# Altium project Electronic Load.PrjPcb (part 1 of 3)
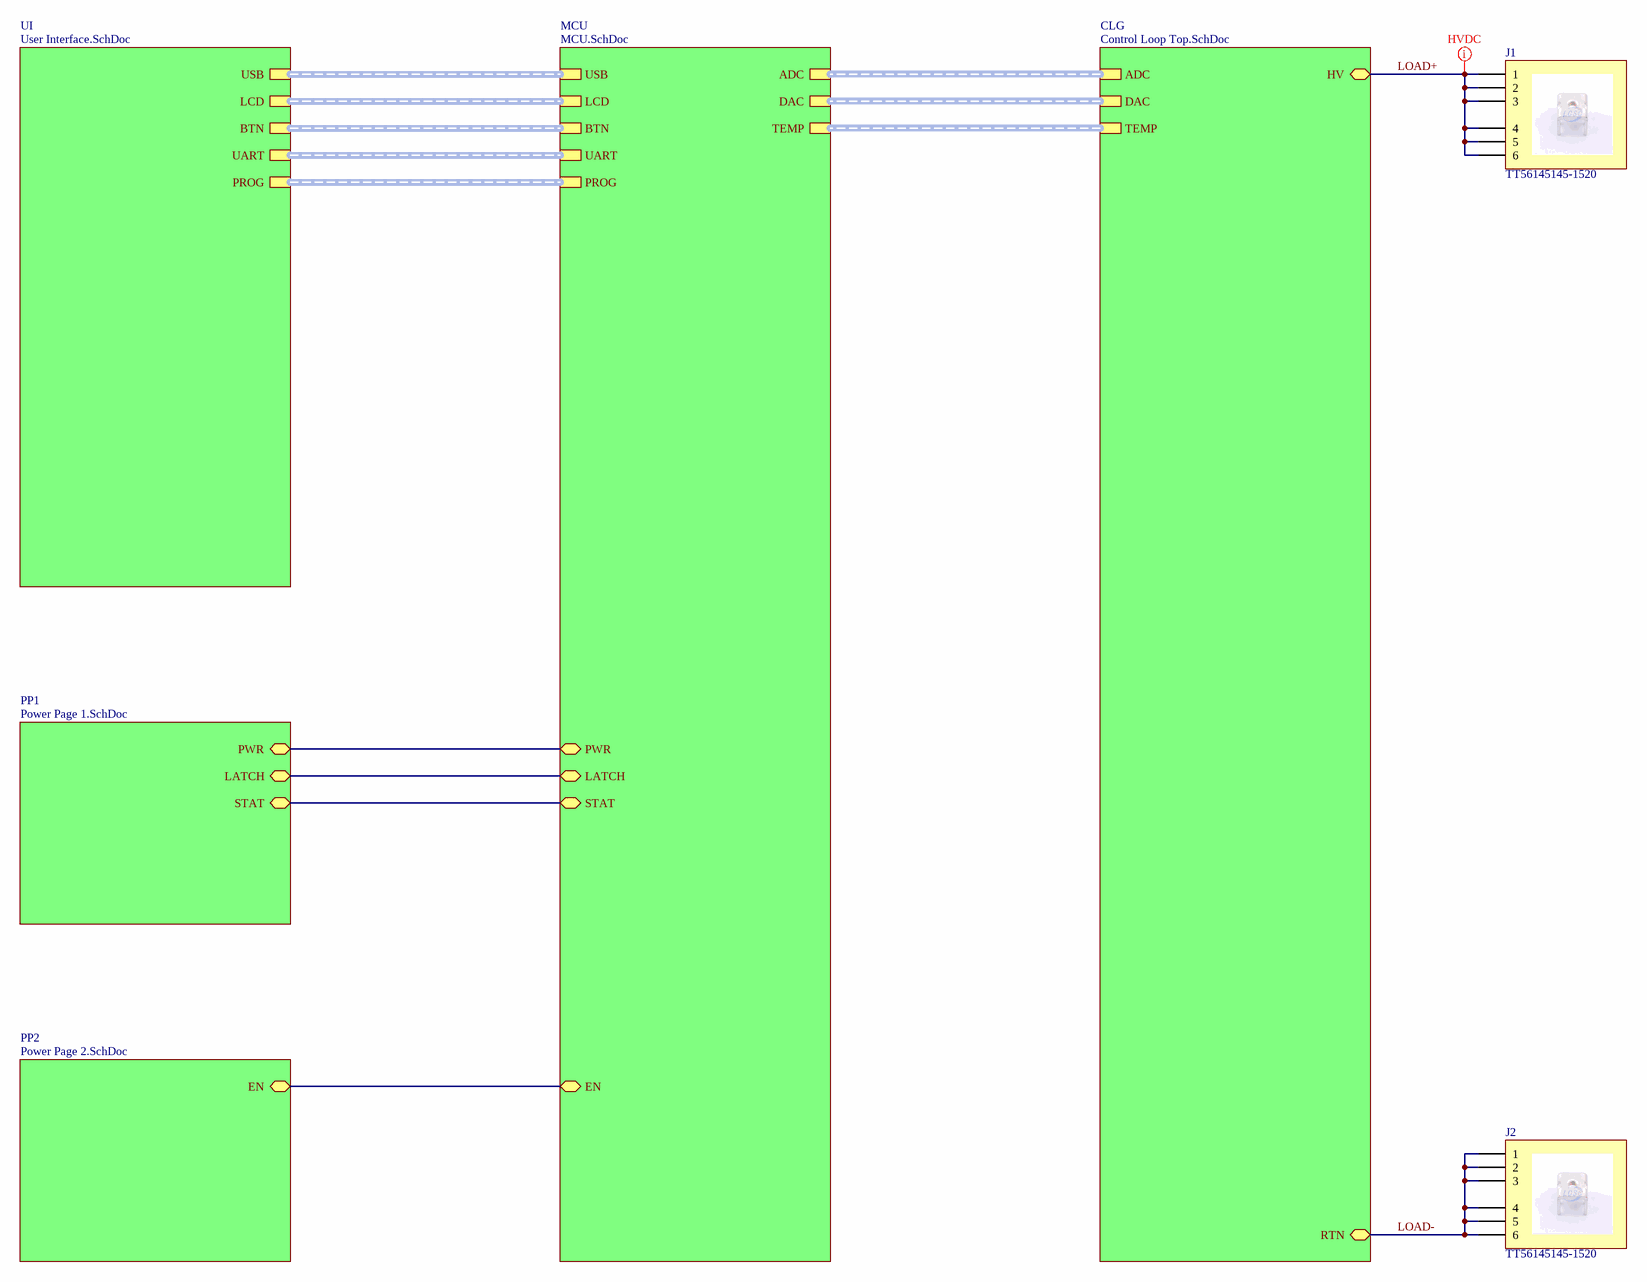
[diagram p0: Electronic Load Top.SchDoc]
Designer: Judd Foster; Revision: A
14 sheets, 689 parts. Net scope: hierarchical (ports join the sheet entries above them; power ports are global).
Board file: Electronic Load.PcbDoc
Sheets:
  Electronic Load Top.SchDoc
    CLG = Control Loop Top.SchDoc
      CL1 = Control Loop.SchDoc
        ICC = IGBT Current Control.SchDoc
        CS = Current Shunts.SchDoc
        PT = Pass Transistor.SchDoc
      DAC = DAC.SchDoc
      CL2 = Control Loop.SchDoc
        ICC = IGBT Current Control.SchDoc
        CS = Current Shunts.SchDoc
        PT = Pass Transistor.SchDoc
      CL3 = Control Loop.SchDoc
        ICC = IGBT Current Control.SchDoc
        CS = Current Shunts.SchDoc
        PT = Pass Transistor.SchDoc
      CL5 = Control Loop.SchDoc
        ICC = IGBT Current Control.SchDoc
        CS = Current Shunts.SchDoc
        PT = Pass Transistor.SchDoc
      CL6 = Control Loop.SchDoc
        ICC = IGBT Current Control.SchDoc
        CS = Current Shunts.SchDoc
        PT = Pass Transistor.SchDoc
      CL4 = Control Loop.SchDoc
        ICC = IGBT Current Control.SchDoc
        CS = Current Shunts.SchDoc
        PT = Pass Transistor.SchDoc
      VS = Voltage Sense.SchDoc
      CL7 = Control Loop.SchDoc
        ICC = IGBT Current Control.SchDoc
        CS = Current Shunts.SchDoc
        PT = Pass Transistor.SchDoc
      CL8 = Control Loop.SchDoc
        ICC = IGBT Current Control.SchDoc
        CS = Current Shunts.SchDoc
        PT = Pass Transistor.SchDoc
      CT = Clamp Top.SchDoc
        C1 = Clamp.SchDoc
        C2 = Clamp.SchDoc
        C3 = Clamp.SchDoc
        C4 = Clamp.SchDoc
        C5 = Clamp.SchDoc
        C6 = Clamp.SchDoc
        C7 = Clamp.SchDoc
        C8 = Clamp.SchDoc
        C9 = Clamp.SchDoc
        C10 = Clamp.SchDoc
    MCU = MCU.SchDoc
    PP1 = Power Page 1.SchDoc
    UI = User Interface.SchDoc
    PP2 = Power Page 2.SchDoc

## Sheet Electronic Load Top.SchDoc
size 406 x 304 mm; SheetNumber: 1; SheetTotal: 14

### Parts
J1  TT56145145-1520  [XFCN_TT56145145-1520]
J2  TT56145145-1520  [XFCN_TT56145145-1520]

### Sub-sheets
CLG = Control Loop Top.SchDoc: HV (bidir), RTN (bidir), DAC (harness DAC), TEMP (harness TEMP), ADC (harness ADC)
MCU = MCU.SchDoc: DAC (harness DAC), TEMP (harness TEMP), ADC (harness ADC), LCD (harness LCD), USB (harness USB), BTN (harness BTN), PWR (bidir), LATCH (bidir), UART (harness UART), PROG (harness PROG), EN (bidir), STAT (bidir)
PP1 = Power Page 1.SchDoc: PWR (bidir), LATCH (bidir), STAT (bidir)
PP2 = Power Page 2.SchDoc: EN (bidir)
UI = User Interface.SchDoc: USB (harness USB), LCD (harness LCD), BTN (harness BTN), UART (harness UART), PROG (harness PROG)

### Nets
GPWR_EN: sheet MCU/EN, sheet PP2/EN
LATCH: sheet MCU/LATCH, sheet PP1/LATCH
LOAD+: J1.1 J1.2 J1.3 J1.4 J1.5 J1.6 ; sheet CLG/HV
LOAD-: J2.1 J2.2 J2.3 J2.4 J2.5 J2.6 ; sheet CLG/RTN
PWR: sheet MCU/PWR, sheet PP1/PWR
STAT: sheet MCU/STAT, sheet PP1/STAT

### Buses and harness runs
harness sheet CLG/ADC = sheet MCU/ADC
harness sheet CLG/DAC = sheet MCU/DAC
harness sheet CLG/TEMP = sheet MCU/TEMP
harness sheet MCU/BTN = sheet UI/BTN
harness sheet MCU/LCD = sheet UI/LCD
harness sheet MCU/PROG = sheet UI/PROG
harness sheet MCU/UART = sheet UI/UART
harness sheet MCU/USB = sheet UI/USB

### Layout directives
net class HVDC: LOAD+

### Notes on the sheet
- Rev
- Sheet Name:
- Date:
- Sheet
- Designer:
- of

### Library data of the parts
J1 J2 = Term,Screw,M5,Top,Thru: 6 M5 Through Hole Screw Connectors ROHS; Manufacturer 1: XFCN; Vendor 1 Part Number: C19724595; Vendor 1: LCSC; Part Name: Term,Screw,M5,Top,Thru; CreatedBy: Judd Foster; HelpURL: https://www.lcsc.com/datasheet/C19724595.pdf; Manufacturer 1 Part Number: TT56145145-1520

## Sheet Control Loop Top.SchDoc
size 406 x 304 mm; SheetNumber: 2; SheetTotal: 14
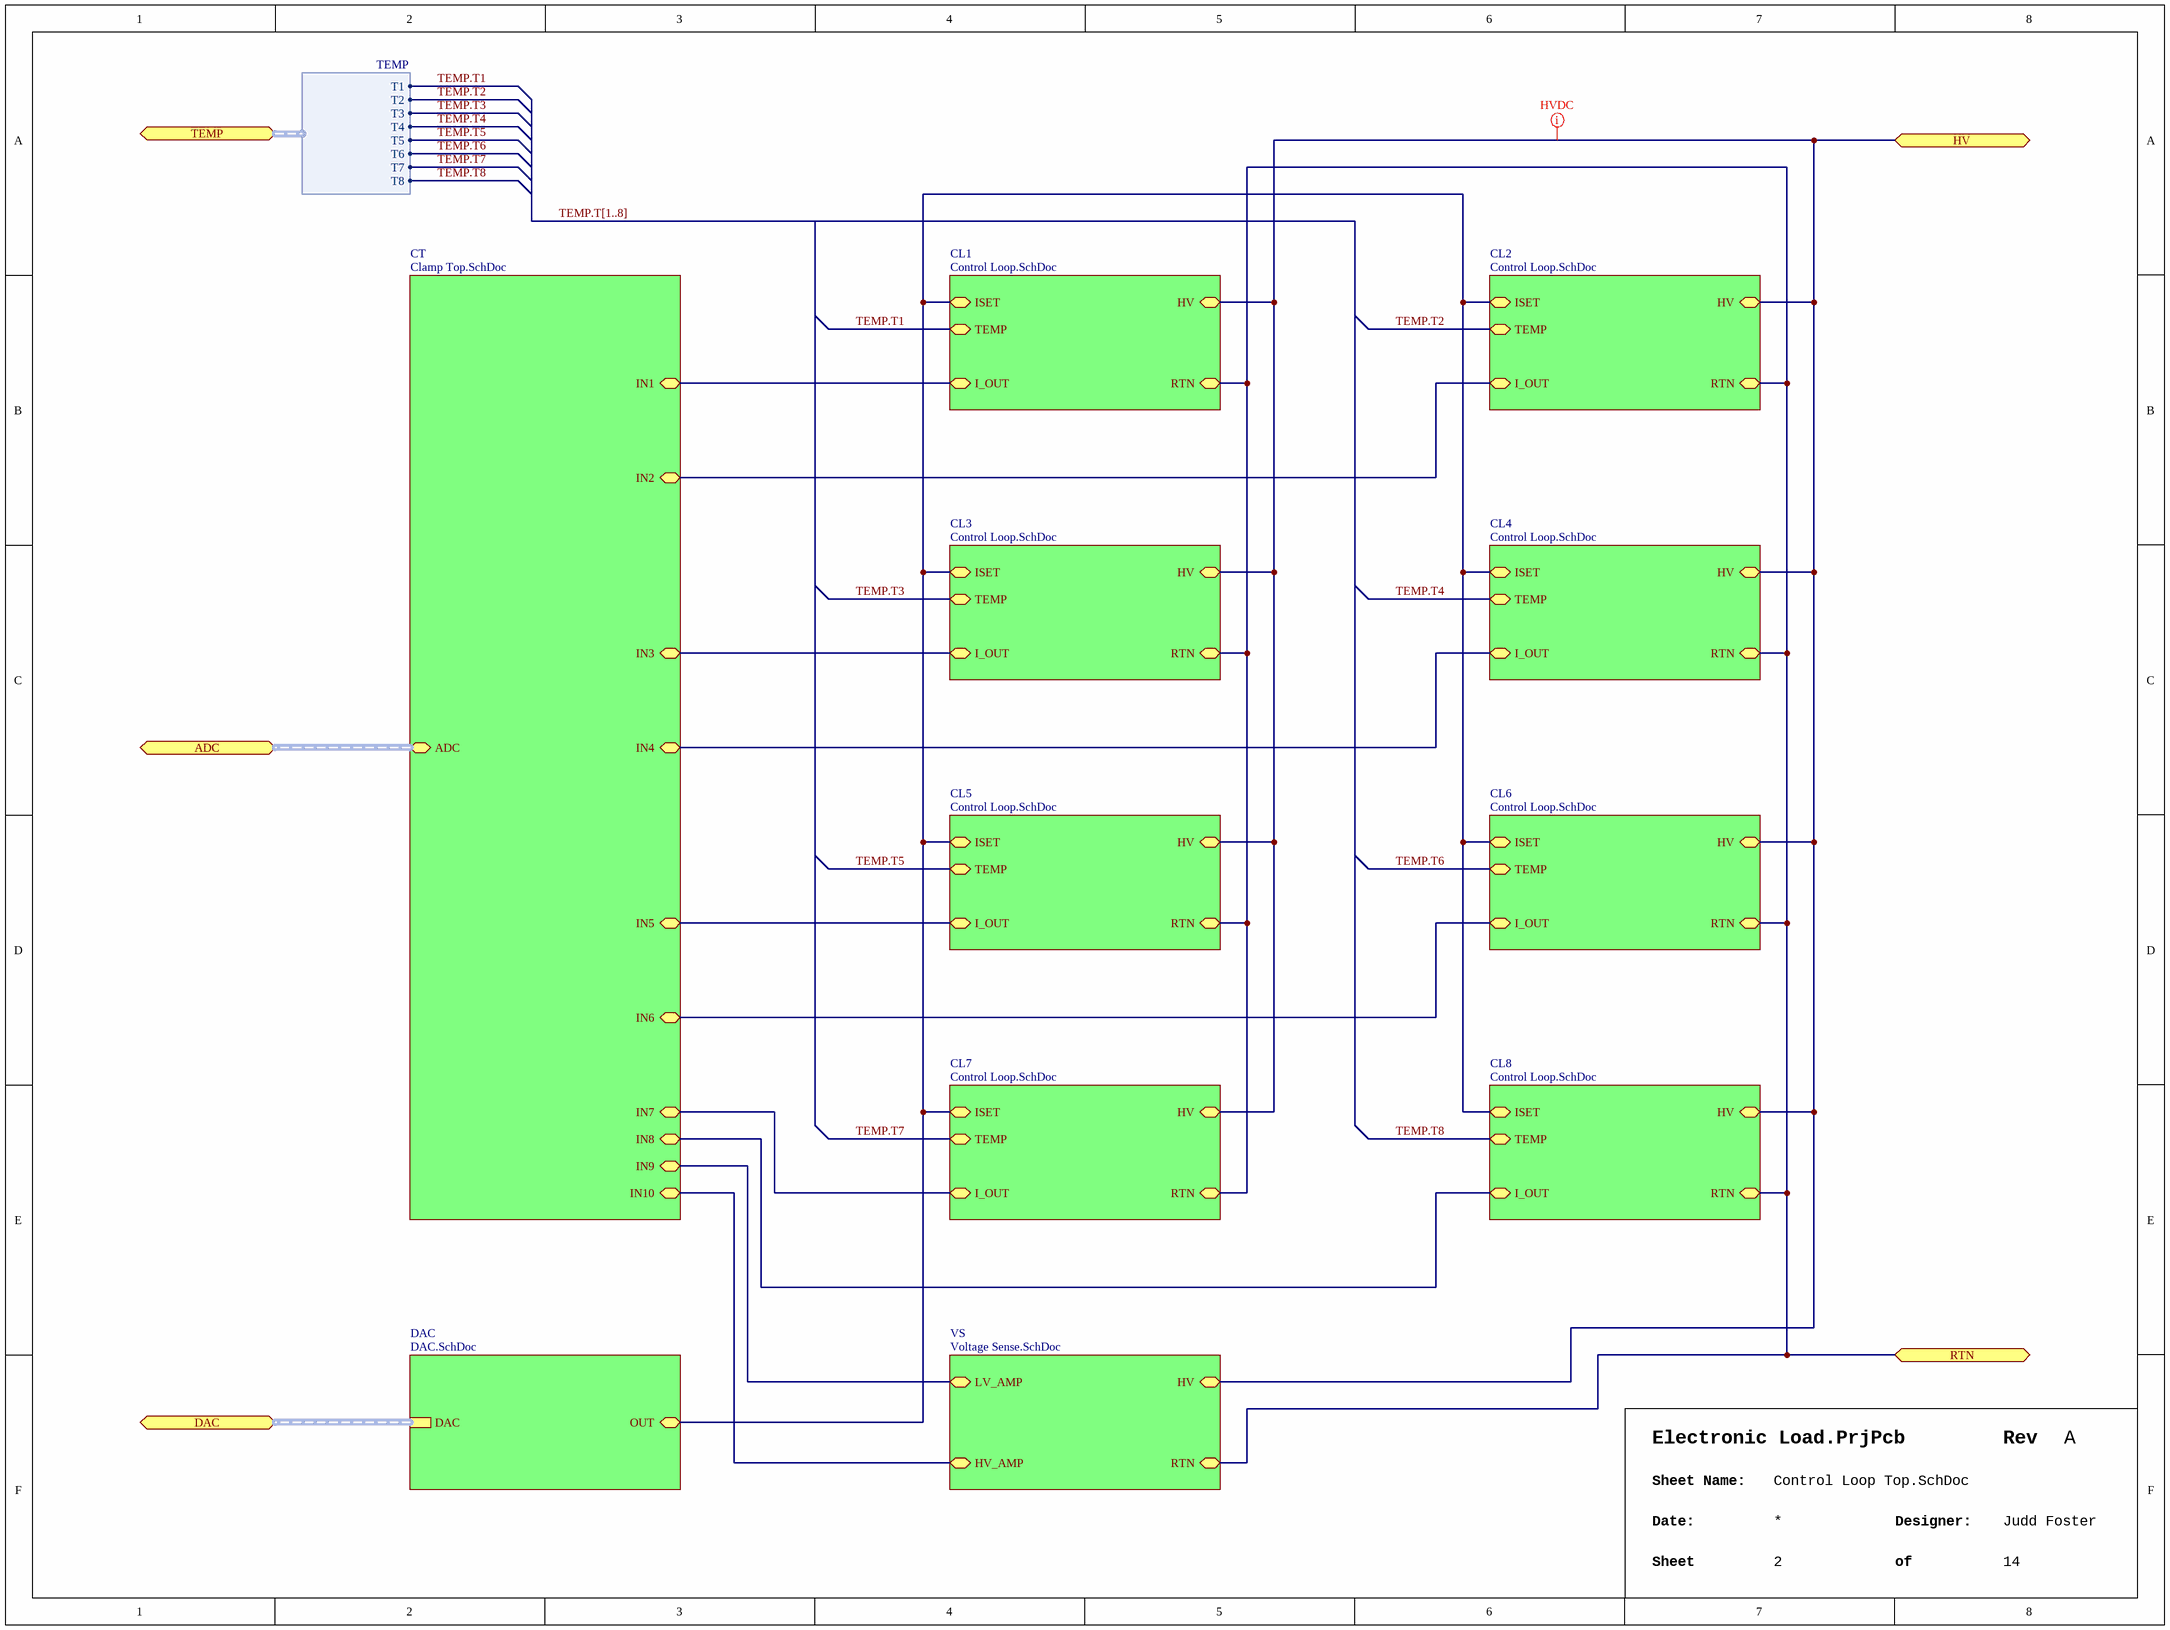
[diagram p1: Control Loop Top.SchDoc]

### Sub-sheets
CL1 = Control Loop.SchDoc: HV (bidir), RTN (bidir), ISET (bidir), TEMP (bidir), I_OUT (bidir)
CL2 = Control Loop.SchDoc: HV (bidir), RTN (bidir), ISET (bidir), TEMP (bidir), I_OUT (bidir)
CL3 = Control Loop.SchDoc: HV (bidir), RTN (bidir), ISET (bidir), TEMP (bidir), I_OUT (bidir)
CL4 = Control Loop.SchDoc: HV (bidir), RTN (bidir), ISET (bidir), TEMP (bidir), I_OUT (bidir)
CL5 = Control Loop.SchDoc: HV (bidir), RTN (bidir), ISET (bidir), TEMP (bidir), I_OUT (bidir)
CL6 = Control Loop.SchDoc: HV (bidir), RTN (bidir), ISET (bidir), TEMP (bidir), I_OUT (bidir)
CL7 = Control Loop.SchDoc: HV (bidir), RTN (bidir), ISET (bidir), TEMP (bidir), I_OUT (bidir)
CL8 = Control Loop.SchDoc: HV (bidir), RTN (bidir), ISET (bidir), TEMP (bidir), I_OUT (bidir)
CT = Clamp Top.SchDoc: IN10 (bidir), IN1 (bidir), IN2 (bidir), IN3 (bidir), IN4 (bidir), IN5 (bidir), IN6 (bidir), IN7 (bidir), IN8 (bidir), IN9 (bidir), ADC (bidir, harness ADC)
DAC = DAC.SchDoc: DAC (harness DAC), OUT (bidir)
VS = Voltage Sense.SchDoc: RTN (bidir), HV (bidir), LV_AMP (bidir), HV_AMP (bidir)

### Ports
ADC (bidir, harness ADC), DAC (bidir, harness DAC), HV (bidir), RTN (bidir), TEMP (bidir, harness TEMP)

### Harnesses
TEMP: T1, T2, T3, T4, T5, T6, T7, T8

### Nets
LOAD+: port HV, sheet CL1/HV, sheet CL2/HV, sheet CL3/HV, sheet CL5/HV, sheet CL6/HV, sheet CL4/HV, sheet VS/HV, sheet CL7/HV, sheet CL8/HV
LOAD-: port RTN, sheet CL1/RTN, sheet CL2/RTN, sheet CL3/RTN, sheet CL5/RTN, sheet CL6/RTN, sheet CL4/RTN, sheet VS/RTN, sheet CL7/RTN, sheet CL8/RTN
TEMP.T1: sheet CL1/TEMP, port TEMP.T1
TEMP.T2: sheet CL2/TEMP, port TEMP.T2
TEMP.T3: sheet CL3/TEMP, port TEMP.T3
TEMP.T4: sheet CL4/TEMP, port TEMP.T4
TEMP.T5: sheet CL5/TEMP, port TEMP.T5
TEMP.T6: sheet CL6/TEMP, port TEMP.T6
TEMP.T7: sheet CL7/TEMP, port TEMP.T7
TEMP.T8: sheet CL8/TEMP, port TEMP.T8
NetC1_CLG_CL1_ICC_2: sheet CL1/I_OUT, sheet CT/IN1
NetC1_CLG_CL2_ICC_2: sheet CL2/I_OUT, sheet CT/IN2
NetC1_CLG_CL3_ICC_2: sheet CL3/I_OUT, sheet CT/IN3
NetC1_CLG_CL4_ICC_2: sheet CL4/I_OUT, sheet CT/IN4
NetC1_CLG_CL5_ICC_2: sheet CL5/I_OUT, sheet CT/IN5
NetC1_CLG_CL6_ICC_2: sheet CL6/I_OUT, sheet CT/IN6
NetC1_CLG_CL7_ICC_2: sheet CL7/I_OUT, sheet CT/IN7
NetC1_CLG_CL8_ICC_2: sheet CL8/I_OUT, sheet CT/IN8
NetC4_1: sheet VS/LV_AMP, sheet CT/IN9
NetC46_1: sheet VS/HV_AMP, sheet CT/IN10
NetR33_CLG_CL1_ICC_1: sheet CL1/ISET, sheet DAC/OUT, sheet CL2/ISET, sheet CL3/ISET, sheet CL5/ISET, sheet CL6/ISET, sheet CL4/ISET, sheet CL7/ISET, sheet CL8/ISET

### Buses and harness runs
bus TEMP.T[1..8]
harness port ADC = sheet CT/ADC
harness port DAC = sheet DAC/DAC

### Layout directives
net class HVDC: LOAD+

### Notes on the sheet
- Rev
- Sheet Name:
- Date:
- Sheet
- Designer:
- of

## Sheet Control Loop.SchDoc
size 406 x 304 mm; SheetNumber: 3; SheetTotal: 14
Used 8 times, as channels CLG/CL1, CLG/CL2, CLG/CL3, CLG/CL5, CLG/CL6, CLG/CL4, CLG/CL7, CLG/CL8. Parts and nets are listed once, with the designators drawn on the sheet.
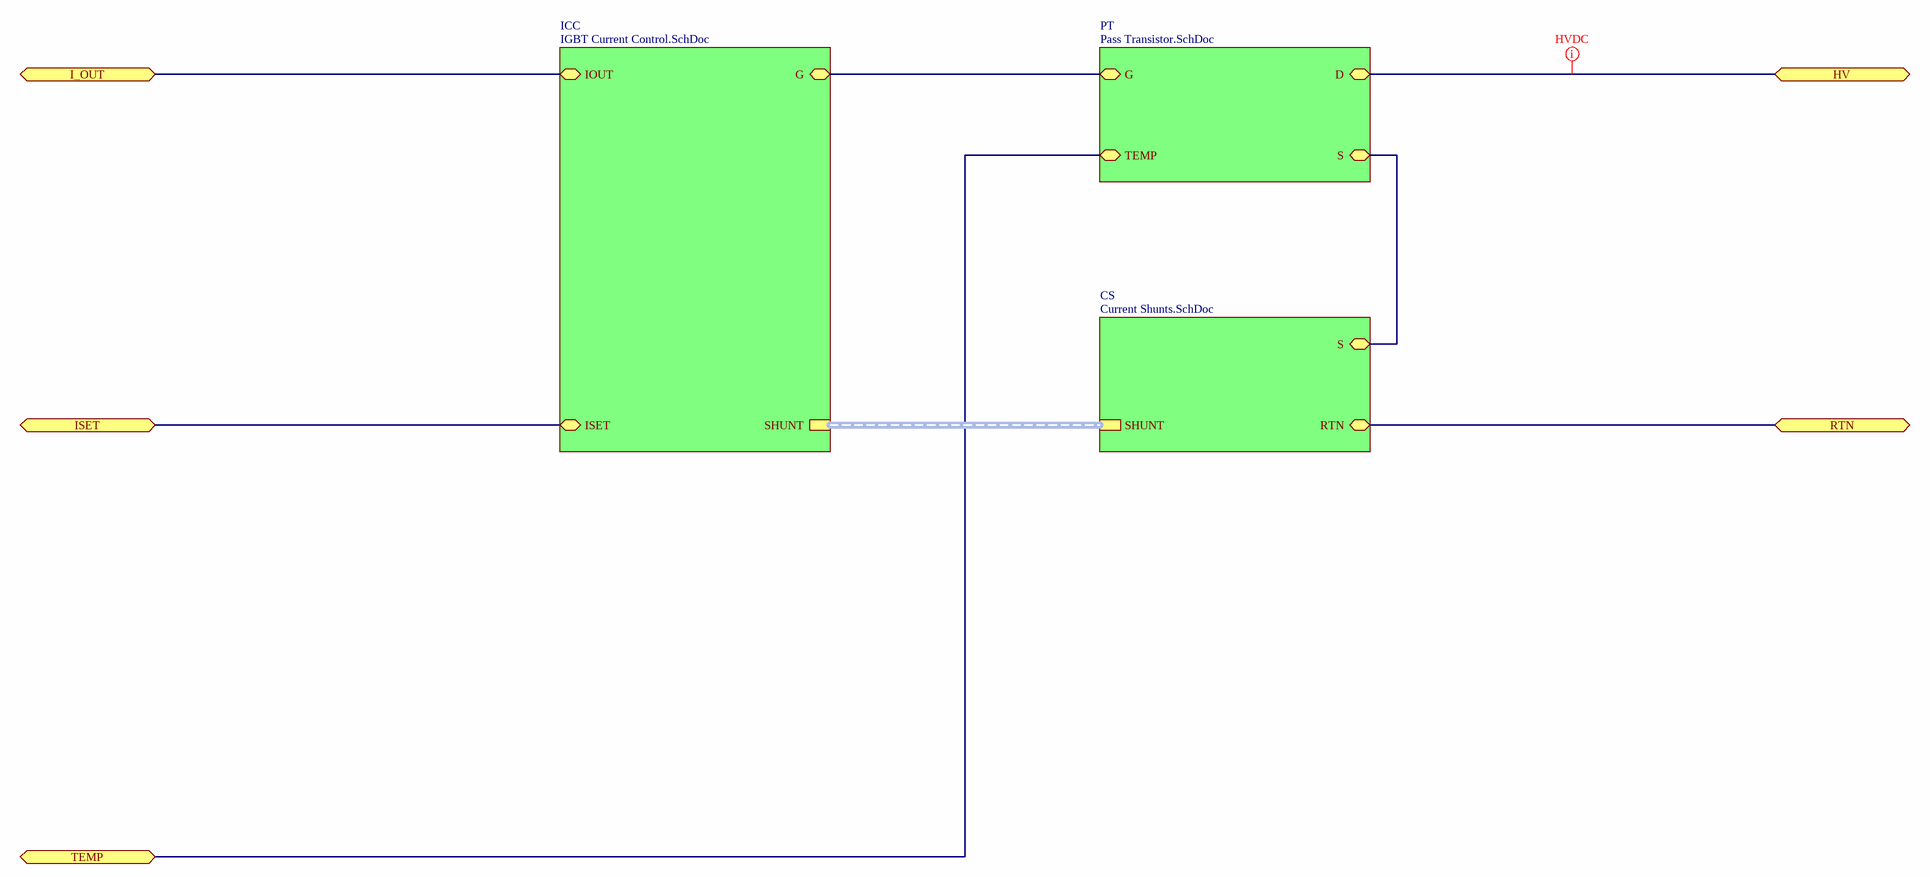
[diagram p2: Control Loop.SchDoc]

### Sub-sheets
CS = Current Shunts.SchDoc: S (bidir), SHUNT (harness SHUNT), RTN (bidir)
ICC = IGBT Current Control.SchDoc: SHUNT (harness SHUNT), ISET (bidir), IOUT (bidir), G (bidir)
PT = Pass Transistor.SchDoc: D (bidir), S (bidir), G (bidir), TEMP (bidir)

### Ports
HV (bidir), I_OUT (bidir), ISET (bidir), RTN (bidir), TEMP (bidir)

### Nets
HV: port HV, sheet PT/D
I_OUT: port I_OUT, sheet ICC/IOUT
ISET: port ISET, sheet ICC/ISET
RTN: port RTN, sheet CS/RTN
TEMP: port TEMP, sheet PT/TEMP
(unnamed): sheet ICC/G, sheet PT/G
(unnamed): sheet CS/S, sheet PT/S

### Channels
CLG/CL1: ports HV=LOAD+ I_OUT=NetC1_CLG_CL1_ICC_2 ISET=NetR33_CLG_CL1_ICC_1 RTN=LOAD- TEMP=TEMP.T1
CLG/CL2: ports HV=LOAD+ I_OUT=NetC1_CLG_CL2_ICC_2 ISET=NetR33_CLG_CL1_ICC_1 RTN=LOAD- TEMP=TEMP.T2
CLG/CL3: ports HV=LOAD+ I_OUT=NetC1_CLG_CL3_ICC_2 ISET=NetR33_CLG_CL1_ICC_1 RTN=LOAD- TEMP=TEMP.T3
CLG/CL5: ports HV=LOAD+ I_OUT=NetC1_CLG_CL5_ICC_2 ISET=NetR33_CLG_CL1_ICC_1 RTN=LOAD- TEMP=TEMP.T5
CLG/CL6: ports HV=LOAD+ I_OUT=NetC1_CLG_CL6_ICC_2 ISET=NetR33_CLG_CL1_ICC_1 RTN=LOAD- TEMP=TEMP.T6
CLG/CL4: ports HV=LOAD+ I_OUT=NetC1_CLG_CL4_ICC_2 ISET=NetR33_CLG_CL1_ICC_1 RTN=LOAD- TEMP=TEMP.T4
CLG/CL7: ports HV=LOAD+ I_OUT=NetC1_CLG_CL7_ICC_2 ISET=NetR33_CLG_CL1_ICC_1 RTN=LOAD- TEMP=TEMP.T7
CLG/CL8: ports HV=LOAD+ I_OUT=NetC1_CLG_CL8_ICC_2 ISET=NetR33_CLG_CL1_ICC_1 RTN=LOAD- TEMP=TEMP.T8

### Buses and harness runs
harness sheet CS/SHUNT = sheet ICC/SHUNT

### Layout directives
net class HVDC: LOAD+

### Notes on the sheet
- Rev
- Sheet Name:
- Date:
- Sheet
- Designer:
- of

## Sheet IGBT Current Control.SchDoc
size 406 x 304 mm; SheetNumber: 4; SheetTotal: 14
Used 8 times, as channels CLG/CL1/ICC, CLG/CL2/ICC, CLG/CL3/ICC, CLG/CL5/ICC, CLG/CL6/ICC, CLG/CL4/ICC, CLG/CL7/ICC, CLG/CL8/ICC. Parts and nets are listed once, with the designators drawn on the sheet.
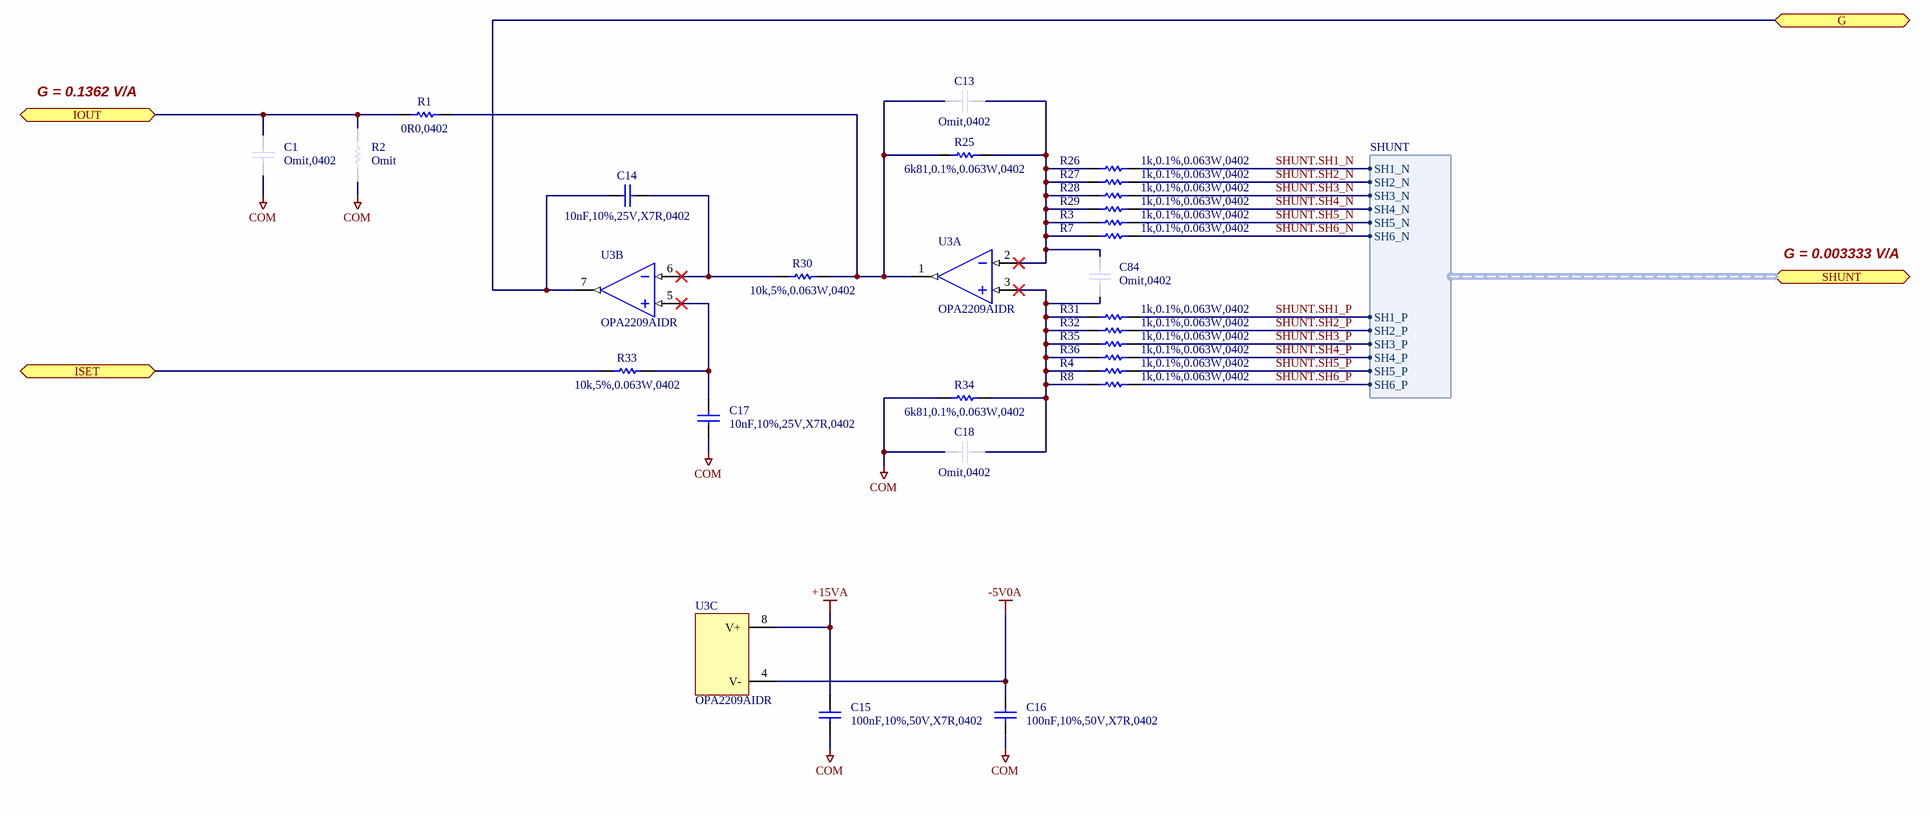
[diagram p3: IGBT Current Control.SchDoc]

### Parts
C1  Omit,0402  [CAPC1005X06N]  (no BOM)
C13  Omit,0402  [CAPC1005X06N]  (no BOM)
C14  10nF,10%,25V,X7R,0402  [CAPC1005X06N]
C15  100nF,10%,50V,X7R,0402  [CAPC1005X06N]
C16  100nF,10%,50V,X7R,0402  [CAPC1005X06N]
C17  10nF,10%,25V,X7R,0402  [CAPC1005X06N]
C18  Omit,0402  [CAPC1005X06N]  (no BOM)
C84  Omit,0402  [CAPC1005X06N]  (no BOM)
R1  0R0,0402  [RESC1005X04N]
R2  Omit  [RESC1005X04N]  (no BOM)
R3  1k,0.1%,0.063W,0402  [RESC1005X04N]
R4  1k,0.1%,0.063W,0402  [RESC1005X04N]
R7  1k,0.1%,0.063W,0402  [RESC1005X04N]
R8  1k,0.1%,0.063W,0402  [RESC1005X04N]
R25  6k81,0.1%,0.063W,0402  [RESC1005X04N]
R26  1k,0.1%,0.063W,0402  [RESC1005X04N]
R27  1k,0.1%,0.063W,0402  [RESC1005X04N]
R28  1k,0.1%,0.063W,0402  [RESC1005X04N]
R29  1k,0.1%,0.063W,0402  [RESC1005X04N]
R30  10k,5%,0.063W,0402  [RESC1005X04N]
R31  1k,0.1%,0.063W,0402  [RESC1005X04N]
R32  1k,0.1%,0.063W,0402  [RESC1005X04N]
R33  10k,5%,0.063W,0402  [RESC1005X04N]
R34  6k81,0.1%,0.063W,0402  [RESC1005X04N]
R35  1k,0.1%,0.063W,0402  [RESC1005X04N]
R36  1k,0.1%,0.063W,0402  [RESC1005X04N]
U3  OPA2209AIDR  [TEXASINSTRUMENTS_PKG_D0008A]  (parts A,B,C of 3)

### Ports
G (bidir), IOUT (bidir), ISET (bidir), SHUNT (bidir, harness SHUNT)

### Harnesses
SHUNT: SH1_P, SH1_N, SH2_P, SH2_N, SH3_P, SH3_N, SH4_P, SH4_N, SH5_N, SH5_P, SH6_N, SH6_P

### Nets
+15VA: C15.2 U3.8(V+)
-5V0A: C16.2 U3.4(V-)
COM: C1.1 C15.1 C16.1 C17.1 C18.1 R2.1 R34.1
G: C14.2 U3.7(OUTB) ; port G
IOUT: C1.2 R1.1 R2.2 ; port IOUT
ISET: R33.1 ; port ISET
SHUNT.SH1_N: R26.2 ; port SHUNT.SH1_N
SHUNT.SH1_P: R31.2 ; port SHUNT.SH1_P
SHUNT.SH2_N: R27.2 ; port SHUNT.SH2_N
SHUNT.SH2_P: R32.2 ; port SHUNT.SH2_P
SHUNT.SH3_N: R28.2 ; port SHUNT.SH3_N
SHUNT.SH3_P: R35.2 ; port SHUNT.SH3_P
SHUNT.SH4_N: R29.2 ; port SHUNT.SH4_N
SHUNT.SH4_P: R36.2 ; port SHUNT.SH4_P
SHUNT.SH5_N: R3.2 ; port SHUNT.SH5_N
SHUNT.SH5_P: R4.2 ; port SHUNT.SH5_P
SHUNT.SH6_N: R7.2 ; port SHUNT.SH6_N
SHUNT.SH6_P: R8.2 ; port SHUNT.SH6_P
NetC13_1: C13.1 R1.2 R25.1 R30.2 U3.1(OUTA)
NetC13_2: C13.2 C84.2 R3.1 R7.1 R25.2 R26.1 R27.1 R28.1 R29.1 U3.2(-INA)
NetC14_1: C14.1 R30.1 U3.6(-INB)
NetC17_2: C17.2 R33.2 U3.5(+INB)
NetC18_2: C18.2 C84.1 R4.1 R8.1 R31.1 R32.1 R34.2 R35.1 R36.1 U3.3(+INA)

### Channels
CLG/CL1/ICC: designators end in _CLG_CL1_ICC; ports G=NetC14_CLG_CL1_ICC_2 IOUT=NetC1_CLG_CL1_ICC_2 ISET=NetR33_CLG_CL1_ICC_1
CLG/CL2/ICC: designators end in _CLG_CL2_ICC; ports G=NetC14_CLG_CL2_ICC_2 IOUT=NetC1_CLG_CL2_ICC_2 ISET=NetR33_CLG_CL1_ICC_1
CLG/CL3/ICC: designators end in _CLG_CL3_ICC; ports G=NetC14_CLG_CL3_ICC_2 IOUT=NetC1_CLG_CL3_ICC_2 ISET=NetR33_CLG_CL1_ICC_1
CLG/CL5/ICC: designators end in _CLG_CL5_ICC; ports G=NetC14_CLG_CL5_ICC_2 IOUT=NetC1_CLG_CL5_ICC_2 ISET=NetR33_CLG_CL1_ICC_1
CLG/CL6/ICC: designators end in _CLG_CL6_ICC; ports G=NetC14_CLG_CL6_ICC_2 IOUT=NetC1_CLG_CL6_ICC_2 ISET=NetR33_CLG_CL1_ICC_1
CLG/CL4/ICC: designators end in _CLG_CL4_ICC; ports G=NetC14_CLG_CL4_ICC_2 IOUT=NetC1_CLG_CL4_ICC_2 ISET=NetR33_CLG_CL1_ICC_1
CLG/CL7/ICC: designators end in _CLG_CL7_ICC; ports G=NetC14_CLG_CL7_ICC_2 IOUT=NetC1_CLG_CL7_ICC_2 ISET=NetR33_CLG_CL1_ICC_1
CLG/CL8/ICC: designators end in _CLG_CL8_ICC; ports G=NetC14_CLG_CL8_ICC_2 IOUT=NetC1_CLG_CL8_ICC_2 ISET=NetR33_CLG_CL1_ICC_1

### Notes on the sheet
- G = 0.1362 V/A
- G = 0.003333 V/A
- Rev
- Sheet Name:
- Date:
- Sheet
- Designer:
- of

### Library data of the parts
C1 C13 C18 C84 = CAP,Omit,0402: Omit; Part Name: CAP,Omit,0402; CreatedBy: Judd Foster; HelpURL: N/A; Manufacturer 1: N/A; Manufacturer 1 Part Number: N/A; Vendor 1: N/A; Vendor 1 Part Number: N/A; Value: Omit
C14 C17 = CAP,Cer,10nF,10%,25V,X7R,0402: 10000pF ï¿½10% 25V Ceramic Capacitor X7R 0402 (1005 Metric); Manufacturer 1: Murata Electronics; Manufacturer 1 Part Number: GCM155R71E103KA37D; Vendor 1 Part Number: 490-6043-1-ND; Vendor 1: Digikey; Value: 10n; Part Name: CAP,Cer,10nF,10%,25V,X7R,0402; CreatedBy: Judd Foster; HelpURL: https://psearch.en.murata.com/capacitor/product/GCM155R71E103KA37%23.pdf
C15 C16 = CAP,Cer,100nF,10%,50V,X7R,0402: 50V 100nF X7R Â±10% 0402 Ceramic Capacitors ROHS; Manufacturer 1: Murata; Manufacturer 1 Part Number: GRM155R71H104KE14D; Vendor 1 Part Number: C77020; Vendor 1: LCSC; Value: 100n; Part Name: CAP,Cer,100nF,10%,50V,X7R,0402; CreatedBy: Judd Foster; HelpURL: https://www.lcsc.com/datasheet/C77020.pdf
R1 = RES,0R0,0402: 0 Ohms Jumper 0.1W, 1/10W Chip Resistor 0402 (1005 Metric) Automotive AEC-Q200 Thick Film; Manufacturer 1: Panasonic Electronic Components; Manufacturer 1 Part Number: ERJ-2GE0R00X; Vendor 1 Part Number: P0.0JCT-ND; Vendor 1: Digikey; Value: 0; Part Name: RES,0R0,0402; CreatedBy: Judd Foster; HelpURL: https://industrial.panasonic.com/cdbs/www-data/pdf/RDA0000/AOA0000C301.pdf
R2 = RES,Omit,0402: Part Name: RES,Omit,0402; CreatedBy: Judd Foster; HelpURL: N/A; Manufacturer 1: N/A; Manufacturer 1 Part Number: N/A; Vendor 1: N/A; Vendor 1 Part Number: N/A; Value: Omit
R3 R4 R7 R8 R26-R29 R31 R32 R35 R36 = RES,1k,0.1%,0.063W,0402: 1 kOhms Â±0.1% 0.063W, 1/16W Chip Resistor 0402 (1005 Metric) Thin Film; Manufacturer 1: YAGEO; Manufacturer 1 Part Number: RT0402BRE071KL; Vendor 1 Part Number: YAG2306CT-ND; Vendor 1: DigiKey; Part Name: RES,1k,0.1%,0.063W,0402; CreatedBy: Judd Foster; HelpURL: https://www.yageo.com/upload/media/product/app/datasheet/rchip/pyu-rt_1-to-0.01_rohs_l.pdf; Value: 1k
R25 R34 = RES,6k81,0.1%,0.063W,0402: 6.81kÎ© 62.5mW 50V Â±25ppm/â„ƒ Thin Film Resistor Â±0.1% 0402 Chip Resistor - Surface Mount RoHS; Manufacturer 1: YAGEO; Manufacturer 1 Part Number: AT0402BRD076K81L; Vendor 1 Part Number: C851098; Vendor 1: LCSC; Part Name: RES,6k81,0.1%,0.063W,0402; CreatedBy: Judd Foster; HelpURL: https://www.lcsc.com/datasheet/C851098.pdf; Value: 6k81
R30 R33 = RES,10k,5%,0.063W,0402: 10 kOhms ï¿½5% 0.063W, 1/16W Chip Resistor 0402 (1005 Metric) Automotive AEC-Q200 Thick Film; Manufacturer 1: Stackpole Electronics Inc; Manufacturer 1 Part Number: RMCF0402JT10K0; Vendor 1 Part Number: RMCF0402JT10K0CT-ND; Vendor 1: DIgikey; Part Name: RES,10k,5%,0.063W,0402; CreatedBy: Judd Foster; HelpURL: https://www.seielect.com/catalog/sei-rmcf_rmcp.pdf; Value: 10k
U3 = OPA2209AIDR: 35uV 18MHz 4.5nA 6.4V/us 130dB SOIC-8 Amplifiers ROHS; Manufacturer 1: Texas Instruments; Vendor 1 Part Number: C2057330; Vendor 1: LCSC; Part Name: OPA2209AIDR; CreatedBy: Judd Foster; HelpURL: https://www.lcsc.com/datasheet/C2057330.pdf; Manufacturer 1 Part Number: OPA2209AIDR

## Sheet Current Shunts.SchDoc
size 406 x 304 mm; SheetNumber: 5; SheetTotal: 14
Used 8 times, as channels CLG/CL1/CS, CLG/CL2/CS, CLG/CL3/CS, CLG/CL5/CS, CLG/CL6/CS, CLG/CL4/CS, CLG/CL7/CS, CLG/CL8/CS. Parts and nets are listed once, with the designators drawn on the sheet.
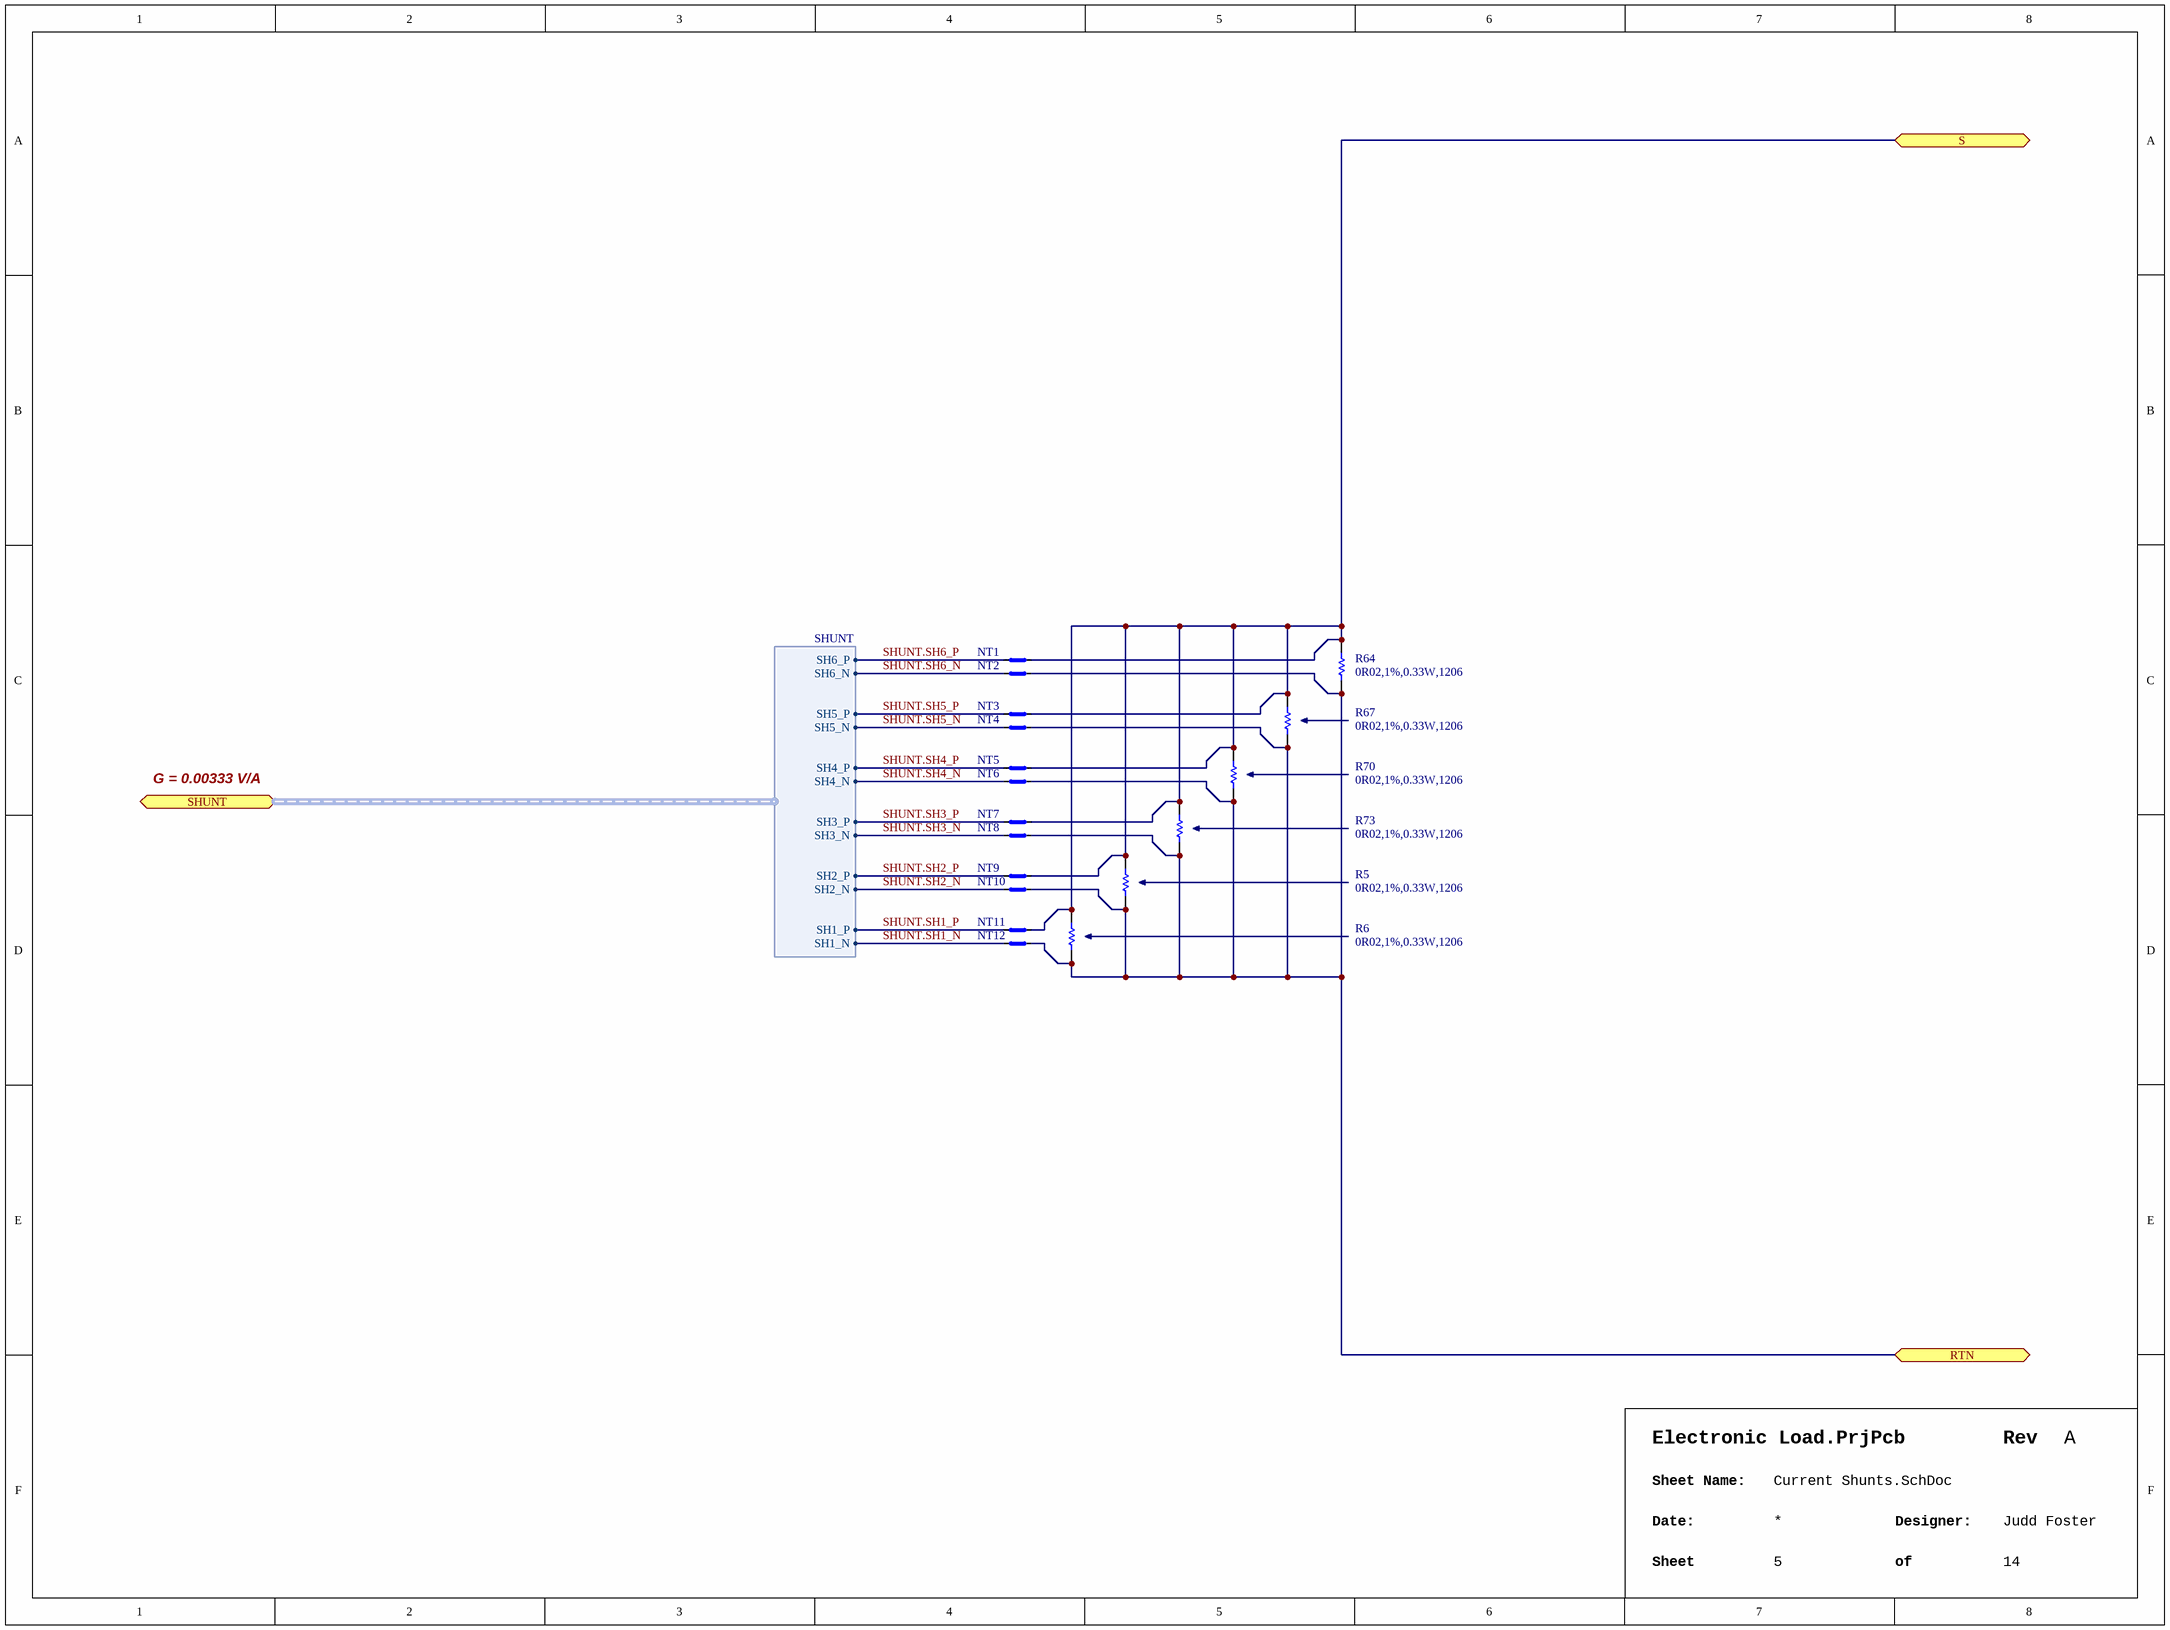
[diagram p4: Current Shunts.SchDoc]

### Parts
NT1  NETTIE  [NETTIE_150X300UM]  (value not drawn)  (net tie, no BOM)
NT2  NETTIE  [NETTIE_150X300UM]  (value not drawn)  (net tie, no BOM)
NT3  NETTIE  [NETTIE_150X300UM]  (value not drawn)  (net tie, no BOM)
NT4  NETTIE  [NETTIE_150X300UM]  (value not drawn)  (net tie, no BOM)
NT5  NETTIE  [NETTIE_150X300UM]  (value not drawn)  (net tie, no BOM)
NT6  NETTIE  [NETTIE_150X300UM]  (value not drawn)  (net tie, no BOM)
NT7  NETTIE  [NETTIE_150X300UM]  (value not drawn)  (net tie, no BOM)
NT8  NETTIE  [NETTIE_150X300UM]  (value not drawn)  (net tie, no BOM)
NT9  NETTIE  [NETTIE_150X300UM]  (value not drawn)  (net tie, no BOM)
NT10  NETTIE  [NETTIE_150X300UM]  (value not drawn)  (net tie, no BOM)
NT11  NETTIE  [NETTIE_150X300UM]  (value not drawn)  (net tie, no BOM)
NT12  NETTIE  [NETTIE_150X300UM]  (value not drawn)  (net tie, no BOM)
R5  0R02,1%,0.33W,1206  [RESC3216X06N]
R6  0R02,1%,0.33W,1206  [RESC3216X06N]
R64  0R02,1%,0.33W,1206  [RESC3216X06N]
R67  0R02,1%,0.33W,1206  [RESC3216X06N]
R70  0R02,1%,0.33W,1206  [RESC3216X06N]
R73  0R02,1%,0.33W,1206  [RESC3216X06N]

### Ports
RTN (bidir), S (bidir), SHUNT (bidir, harness SHUNT)

### Harnesses
SHUNT: SH1_P, SH1_N, SH2_P, SH2_N, SH3_P, SH3_N, SH4_P, SH4_N, SH5_P, SH5_N, SH6_P, SH6_N

### Nets
RTN: NT2.2 NT4.2 NT6.2 NT8.2 NT10.2 NT12.2 R5.1 R6.1 R64.1 R67.1 R70.1 R73.1 ; port RTN
S: NT1.2 NT3.2 NT5.2 NT7.2 NT9.2 NT11.2 R5.2 R6.2 R64.2 R67.2 R70.2 R73.2 ; port S
SHUNT.SH1_N: NT12.1 ; port SHUNT.SH1_N
SHUNT.SH1_P: NT11.1 ; port SHUNT.SH1_P
SHUNT.SH2_N: NT10.1 ; port SHUNT.SH2_N
SHUNT.SH2_P: NT9.1 ; port SHUNT.SH2_P
SHUNT.SH3_N: NT8.1 ; port SHUNT.SH3_N
SHUNT.SH3_P: NT7.1 ; port SHUNT.SH3_P
SHUNT.SH4_N: NT6.1 ; port SHUNT.SH4_N
SHUNT.SH4_P: NT5.1 ; port SHUNT.SH4_P
SHUNT.SH5_N: NT4.1 ; port SHUNT.SH5_N
SHUNT.SH5_P: NT3.1 ; port SHUNT.SH5_P
SHUNT.SH6_N: NT2.1 ; port SHUNT.SH6_N
SHUNT.SH6_P: NT1.1 ; port SHUNT.SH6_P

### Channels
CLG/CL1/CS: designators end in _CLG_CL1_CS; ports RTN=LOAD- S=SOURCE
CLG/CL2/CS: designators end in _CLG_CL2_CS; ports RTN=LOAD- S=SOURCE
CLG/CL3/CS: designators end in _CLG_CL3_CS; ports RTN=LOAD- S=SOURCE
CLG/CL5/CS: designators end in _CLG_CL5_CS; ports RTN=LOAD- S=SOURCE
CLG/CL6/CS: designators end in _CLG_CL6_CS; ports RTN=LOAD- S=SOURCE
CLG/CL4/CS: designators end in _CLG_CL4_CS; ports RTN=LOAD- S=SOURCE
CLG/CL7/CS: designators end in _CLG_CL7_CS; ports RTN=LOAD- S=SOURCE
CLG/CL8/CS: designators end in _CLG_CL8_CS; ports RTN=LOAD- S=SOURCE

### Notes on the sheet
- G = 0.00333 V/A
- Rev
- Sheet Name:
- Date:
- Sheet
- Designer:
- of

### Library data of the parts
NT1-NT12 = NETTIE,150X300UM: Net Tie; Part Name: NETTIE,150X300UM; CreatedBy: Judd Foster; HelpURL: N/A; Manufacturer 1: N/A; Manufacturer 1 Part Number: N/A; Vendor 1: N/A; Vendor 1 Part Number: N/A
R5 R6 R64 R67 R70 R73 = RES,0R02,1%,0.33W,1206: 333mW 20mÎ© 200V Â±1000ppm/â„ƒ Thick Film Resistor Â±1% 1206 Chip Resistor - Surface Mount ROHS; Manufacturer 1: UNI-ROYAL; Manufacturer 1 Part Number: 1206W3F200MT5E; Vendor 1 Part Number: C2765435; Vendor 1: LCSC; Value: 0.02; Part Name: RES,0R02,1%,0.33W,1206; CreatedBy: Judd Foster; HelpURL: https://www.lcsc.com/datasheet/C2765435.pdf

## Sheet Pass Transistor.SchDoc
size 406 x 304 mm; SheetNumber: 6; SheetTotal: 14
Used 8 times, as channels CLG/CL1/PT, CLG/CL2/PT, CLG/CL3/PT, CLG/CL5/PT, CLG/CL6/PT, CLG/CL4/PT, CLG/CL7/PT, CLG/CL8/PT. Parts and nets are listed once, with the designators drawn on the sheet.
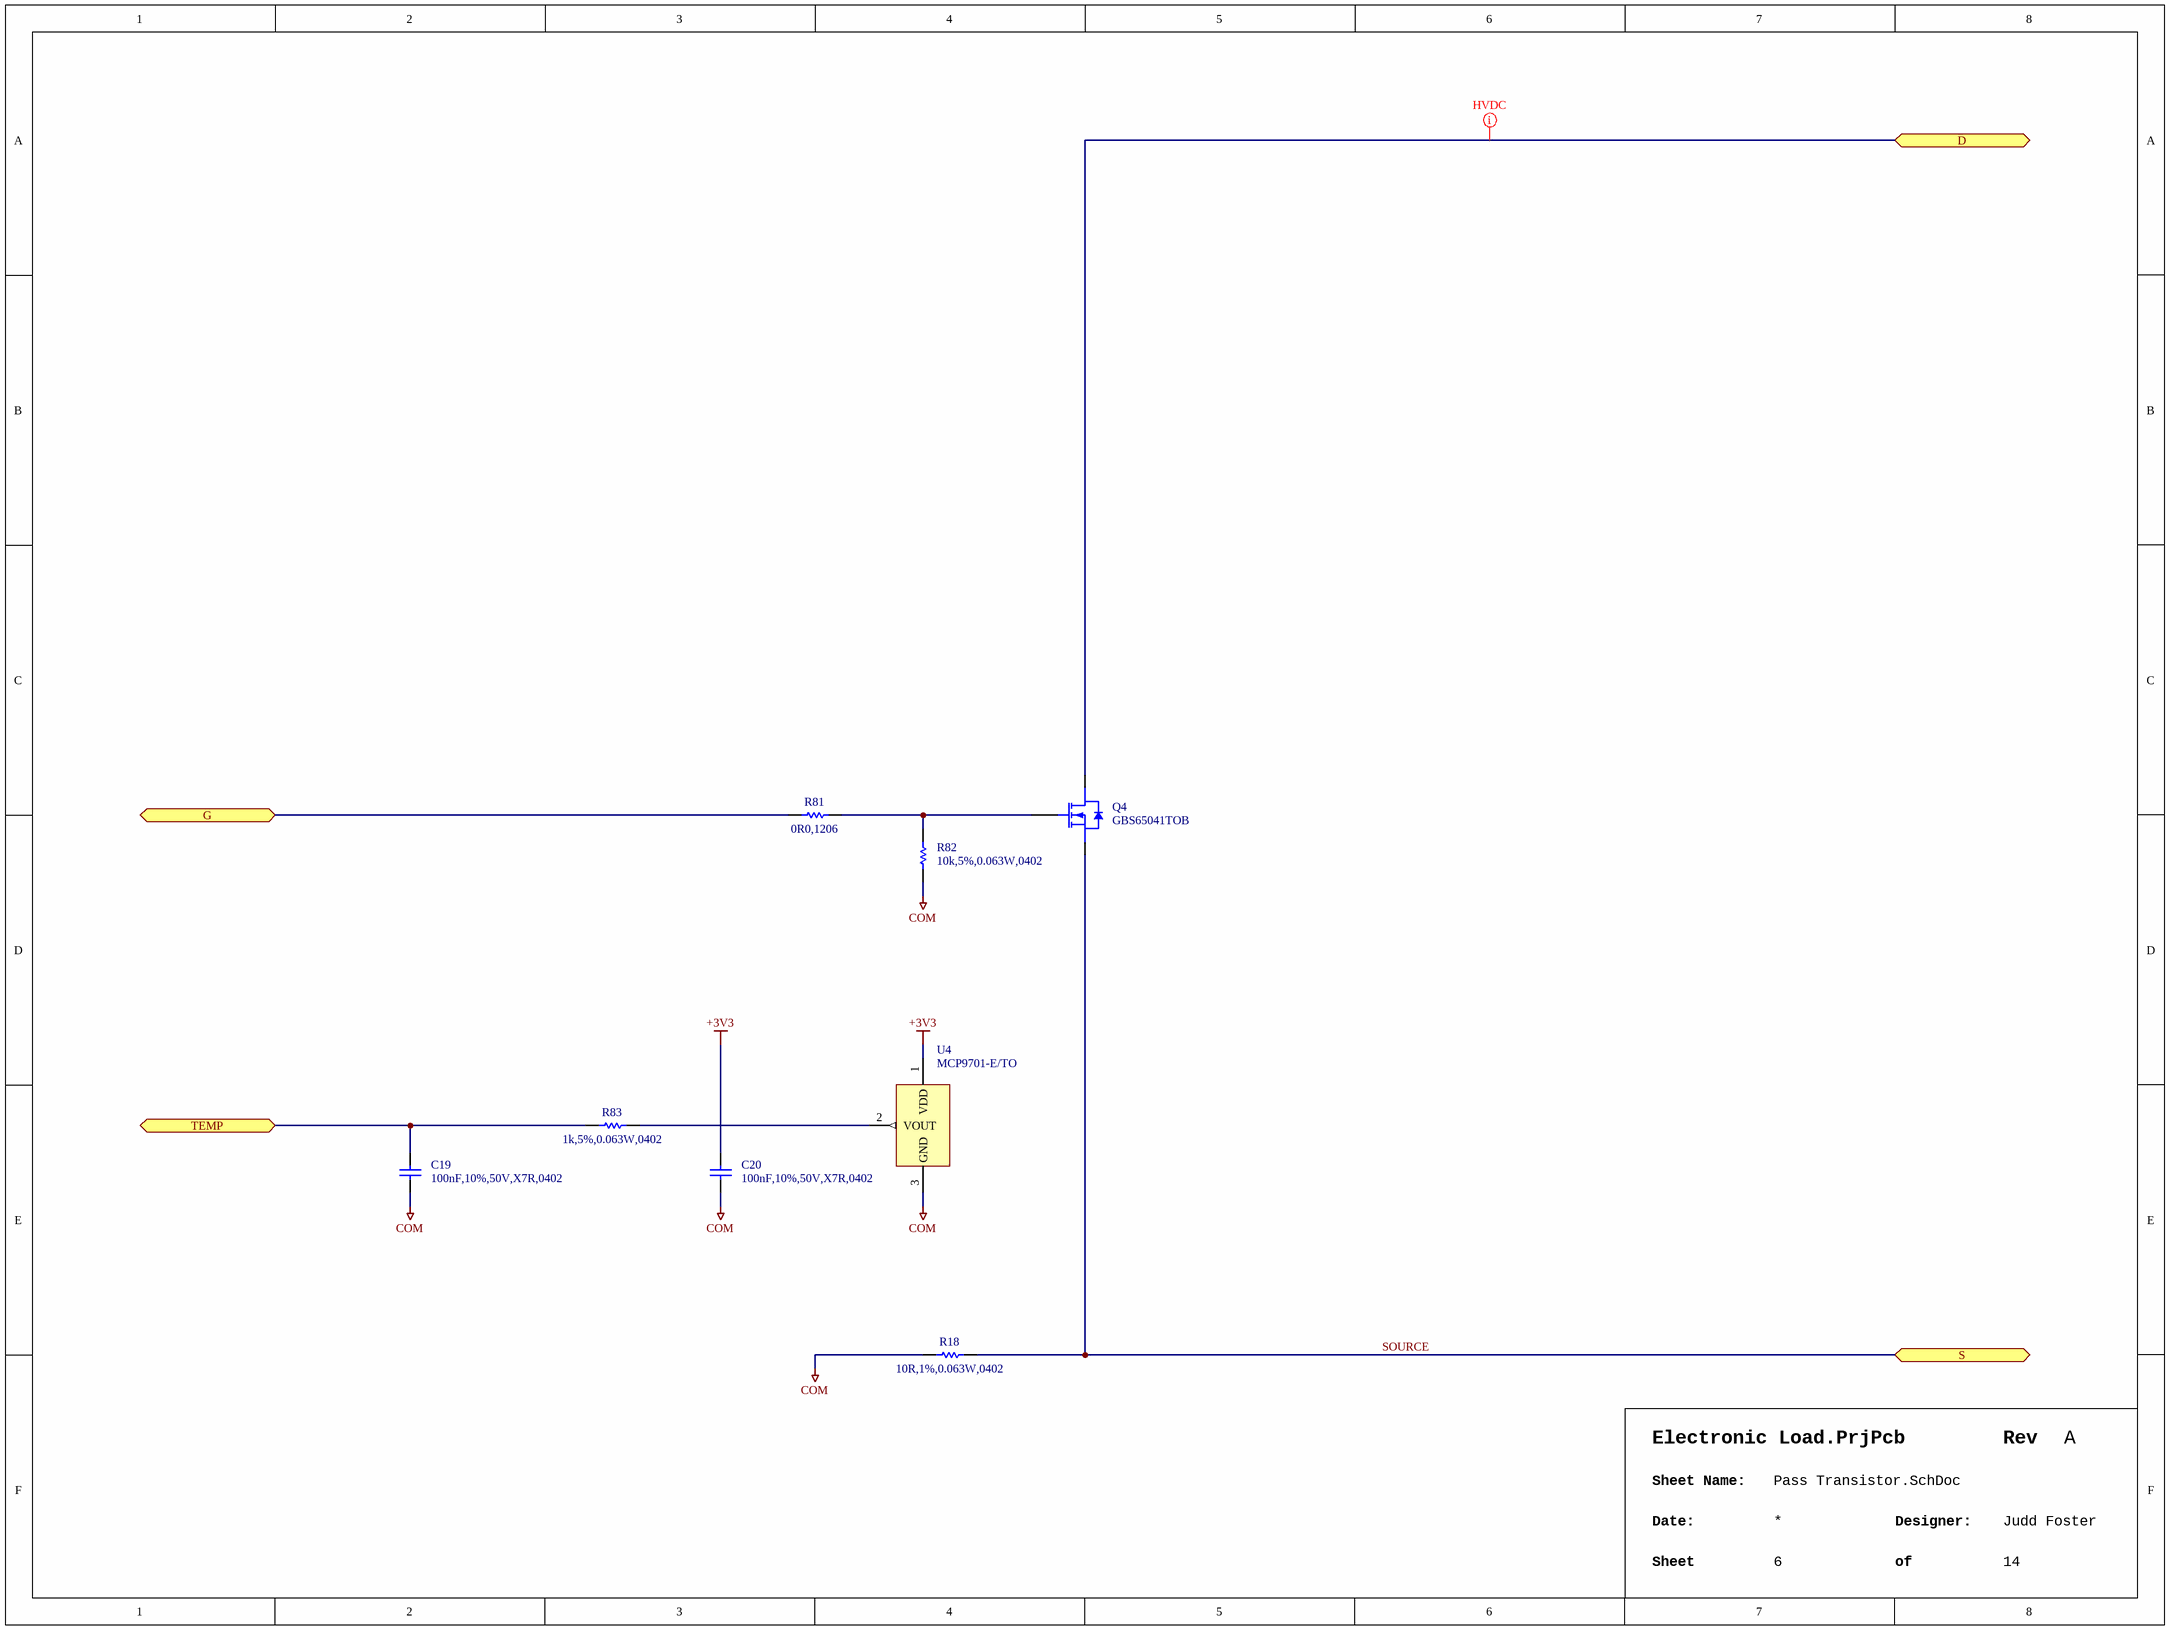
[diagram p5: Pass Transistor.SchDoc]

### Parts
C19  100nF,10%,50V,X7R,0402  [CAPC1005X06N]
C20  100nF,10%,50V,X7R,0402  [CAPC1005X06N]
Q4  GBS65041TOB  [GOSEMICON_PKG_TO-247]
R18  10R,1%,0.063W,0402  [RESC1005X04N]
R81  0R0,1206  [RESC3216X06N]
R82  10k,5%,0.063W,0402  [RESC1005X04N]
R83  1k,5%,0.063W,0402  [RESC1005X04N]
U4  MCP9701-E/TO  [TO-92]

### Ports
D (bidir), G (bidir), S (bidir), TEMP (bidir)

### Nets
+3V3: C20.2 U4.1(VDD)
COM: C19.1 C20.1 R18.1 R82.1 U4.3(GND)
D: Q4.2(D) ; port D
G: R81.1 ; port G
SOURCE: Q4.3(S) R18.2 ; port S
TEMP: C19.2 R83.1 ; port TEMP
NetQ4_1: Q4.1(G) R81.2 R82.2
NetR83_2: R83.2 U4.2(VOUT)

### Channels
CLG/CL1/PT: designators end in _CLG_CL1_PT; ports D=LOAD+ G=NetC14_CLG_CL1_ICC_2 S=SOURCE TEMP=TEMP.T1
CLG/CL2/PT: designators end in _CLG_CL2_PT; ports D=LOAD+ G=NetC14_CLG_CL2_ICC_2 S=SOURCE TEMP=TEMP.T2
CLG/CL3/PT: designators end in _CLG_CL3_PT; ports D=LOAD+ G=NetC14_CLG_CL3_ICC_2 S=SOURCE TEMP=TEMP.T3
CLG/CL5/PT: designators end in _CLG_CL5_PT; ports D=LOAD+ G=NetC14_CLG_CL5_ICC_2 S=SOURCE TEMP=TEMP.T5
CLG/CL6/PT: designators end in _CLG_CL6_PT; ports D=LOAD+ G=NetC14_CLG_CL6_ICC_2 S=SOURCE TEMP=TEMP.T6
CLG/CL4/PT: designators end in _CLG_CL4_PT; ports D=LOAD+ G=NetC14_CLG_CL4_ICC_2 S=SOURCE TEMP=TEMP.T4
CLG/CL7/PT: designators end in _CLG_CL7_PT; ports D=LOAD+ G=NetC14_CLG_CL7_ICC_2 S=SOURCE TEMP=TEMP.T7
CLG/CL8/PT: designators end in _CLG_CL8_PT; ports D=LOAD+ G=NetC14_CLG_CL8_ICC_2 S=SOURCE TEMP=TEMP.T8

### Layout directives
net class HVDC: LOAD+

### Notes on the sheet
- Rev
- Sheet Name:
- Date:
- Sheet
- Designer:
- of

### Library data of the parts
C19 C20 = CAP,Cer,100nF,10%,50V,X7R,0402: as C15 on sheet IGBT Current Control; Part Name: CAP,Cer,100nF,10%,50V,X7R,0402; CreatedBy: Judd Foster; HelpURL: https://www.lcsc.com/datasheet/C77020.pdf
Q4 = MOSFET,N Ch,650V,66A: 650V 66A 313W 34mÎ©@10V 4V@1mA 1 N-Channel TO-247 Single FETs, MOSFETs ROHS; Manufacturer 1: GOSEMICON; Vendor 1 Part Number: C5451736; Vendor 1: LCSC; Part Name: MOSFET,N Ch,650V,66A; CreatedBy: Judd Foster; HelpURL: https://www.lcsc.com/datasheet/C5451736.pdf; Manufacturer 1 Part Number: GBS65041TOB
R18 = RES,10R,1%,0.063W,0402: 10 Ohms ï¿½1% 0.063W, 1/16W Chip Resistor 0402 (1005 Metric) Automotive AEC-Q200 Thick Film; Manufacturer 1: Panasonic Electronic Components; Manufacturer 1 Part Number: ERJ-2RKF10R0X; Vendor 1 Part Number: P10.0LCT-ND; Vendor 1: Digikey; Value: 10; Part Name: RES,10R,1%,0.063W,0402; CreatedBy: Judd Foster; HelpURL: https://industrial.panasonic.com/cdbs/www-data/pdf/RDA0000/AOA0000C304.pdf
R81 = RES,0R0,1206: 0 Ohms Jumper Chip Resistor 1206 (3216 Metric) Automotive AEC-Q200 Thick Film; Manufacturer 1: Stackpole Electronics Inc; Manufacturer 1 Part Number: RMCF1206ZT0R00; Vendor 1 Part Number: RMCF1206ZT0R00CT-ND; Vendor 1: Digikey; Value: 0; Part Name: RES,0R0,1206; CreatedBy: Judd Foster; HelpURL: https://www.seielect.com/catalog/sei-rmcf_rmcp.pdf
R82 = RES,10k,5%,0.063W,0402: as R30 on sheet IGBT Current Control; Part Name: RES,10k,5%,0.063W,0402; CreatedBy: Judd Foster; HelpURL: https://www.seielect.com/catalog/sei-rmcf_rmcp.pdf; Value: 10k
R83 = RES,1k,5%,0.063W,0402: 1 kOhms ï¿½5% 0.063W, 1/16W Chip Resistor 0402 (1005 Metric) Automotive AEC-Q200 Thick Film; Manufacturer 1: Stackpole Electronics Inc; Manufacturer 1 Part Number: RMCF0402JT1K00; Vendor 1 Part Number: RMCF0402JT1K00CT-ND; Vendor 1: DIgikey; Part Name: RES,1k,5%,0.063W,0402; CreatedBy: Judd Foster; HelpURL: https://www.seielect.com/catalog/sei-rmcf_rmcp.pdf; Value: 1k
U4 = MCP9701-E/TO: Temperature Sensor Analog, Local -10ï¿½C ~ 125ï¿½C 19.5mV/ï¿½C TO-92-3; Manufacturer 1: Microchip Technology; Vendor 1 Part Number: MCP9701-E/TO-ND; Vendor 1: Digikey; Part Name: MCP9701-E/TO; CreatedBy: Judd Foster; HelpURL: http://ww1.microchip.com/downloads/en/DeviceDoc/20001942G.pdf; Manufacturer 1 Part Number: MCP9701-E/TO

## Sheet DAC.SchDoc
size 406 x 304 mm; SheetNumber: 7; SheetTotal: 14
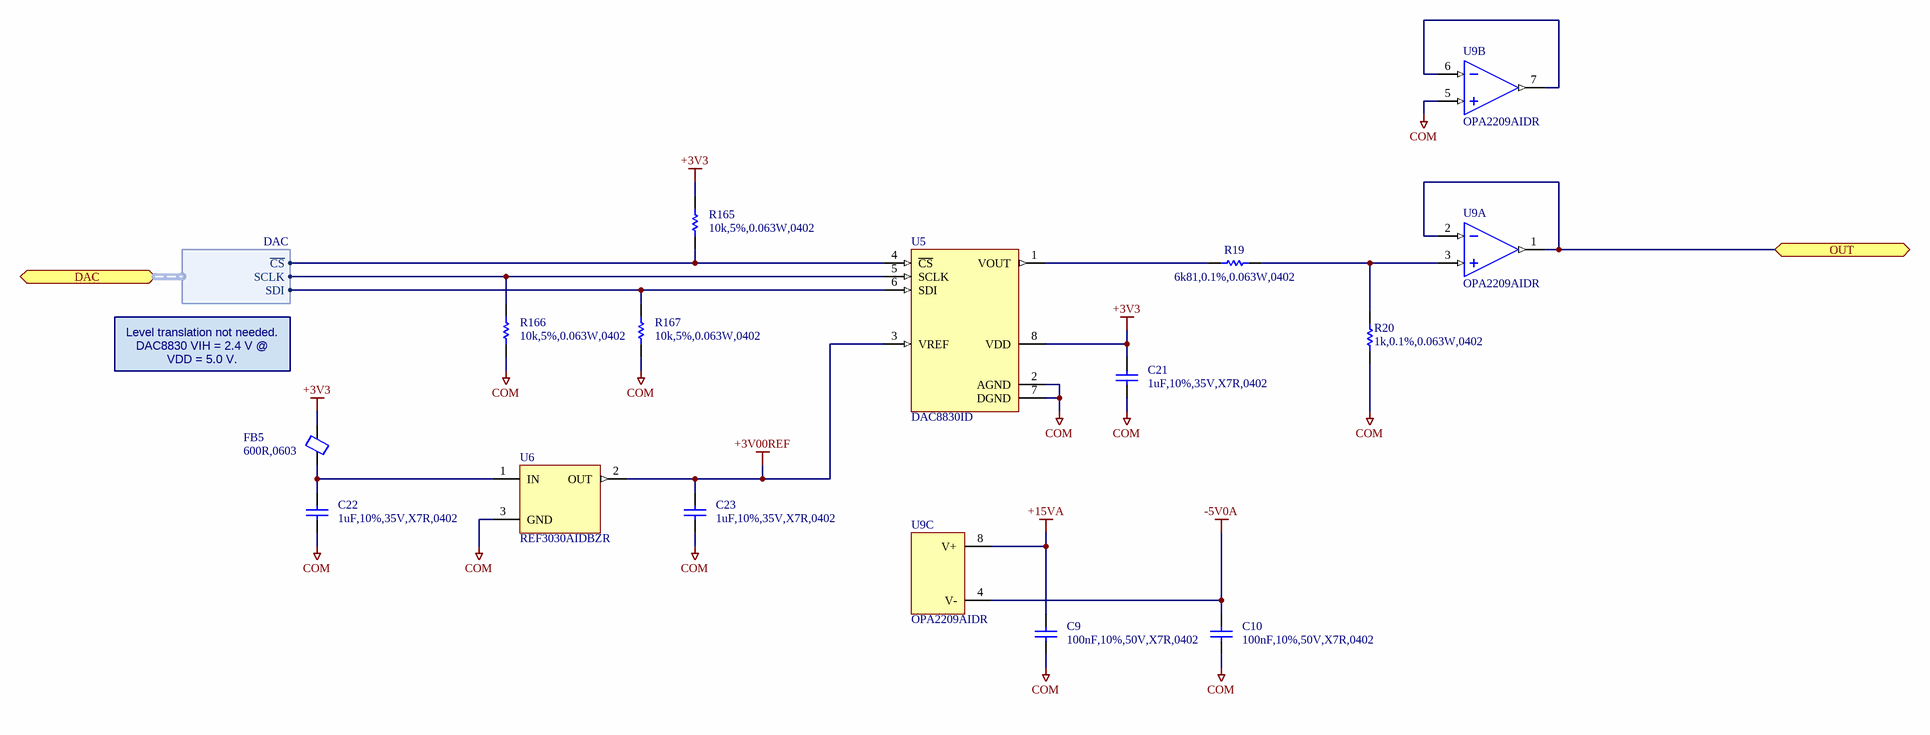
[diagram p6: DAC.SchDoc]

### Parts
C9  100nF,10%,50V,X7R,0402  [CAPC1005X06N]
C10  100nF,10%,50V,X7R,0402  [CAPC1005X06N]
C21  1uF,10%,35V,X7R,0402  [CAPC1005X06N]
C22  1uF,10%,35V,X7R,0402  [CAPC1005X06N]
C23  1uF,10%,35V,X7R,0402  [CAPC1005X06N]
FB5  600R,0603  [INDC_0603]
R19  6k81,0.1%,0.063W,0402  [RESC1005X04N]
R20  1k,0.1%,0.063W,0402  [RESC1005X04N]
R165  10k,5%,0.063W,0402  [RESC1005X04N]
R166  10k,5%,0.063W,0402  [RESC1005X04N]
R167  10k,5%,0.063W,0402  [RESC1005X04N]
U5  DAC8830ID  [TEXASINSTRUMENTS_PKG_D0008A]
U6  REF3030AIDBZR  [SOT95P237X112-3N]
U9  OPA2209AIDR  [TEXASINSTRUMENTS_PKG_D0008A]  (parts A,B,C of 3)

### Ports
DAC (bidir, harness DAC), OUT (bidir)

### Harnesses
DAC: SDI, SCLK, ~{CS}

### Nets
+3V00REF: C23.2 U5.3(VREF) U6.2(OUT)
+3V3: C21.2 FB5.2 R165.1 U5.8(VDD)
+15VA: C9.2 U9.8(V+)
-5V0A: C10.2 U9.4(V-)
COM: C9.1 C10.1 C21.1 C22.1 C23.1 R20.1 R166.2 R167.2 U5.2(AGND) U5.7(DGND) U6.3(GND) U9.5(+INB)
DAC.CS_N: R165.2 U5.4(~{CS}) ; port DAC.~{CS}
DAC.SCLK: R166.1 U5.5(SCLK) ; port DAC.SCLK
DAC.SDI: R167.1 U5.6(SDI) ; port DAC.SDI
NetC22_2: C22.2 FB5.1 U6.1(IN)
NetR19_1: R19.1 U5.1(VOUT)
NetR19_2: R19.2 R20.2 U9.3(+INA)
NetR33_CLG_CL1_ICC_1: U9.1(OUTA) U9.2(-INA) ; port OUT
NetU9_6: U9.6(-INB) U9.7(OUTB)

### Notes on the sheet
- Level translation not needed.
  DAC8830 VIH = 2.4 V @
  VDD = 5.0 V.
- Rev
- Sheet Name:
- Date:
- Sheet
- Designer:
- of

### Library data of the parts
C9 C10 = CAP,Cer,100nF,10%,50V,X7R,0402: as C15 on sheet IGBT Current Control; Part Name: CAP,Cer,100nF,10%,50V,X7R,0402; CreatedBy: Judd Foster; HelpURL: https://www.lcsc.com/datasheet/C77020.pdf
C21-C23 = CAP,Cer,1uF,35VDC,X5R,0402: 1 ï¿½F ï¿½10% 35V Ceramic Capacitor X5R 0402 (1005 Metric); Manufacturer 1: TDK Corporation; Manufacturer 1 Part Number: C1005X5R1V105K050BC; Vendor 1 Part Number: 445-9073-1-ND; Vendor 1: Digikey; Value: 1u; Part Name: CAP,Cer,1uF,35VDC,X5R,0402; CreatedBy: Judd Foster; HelpURL: https://product.tdk.com/info/en/catalog/datasheets/mlcc_commercial_general_en.pdf?ref_disty=digikey
FB5 = FERRITE,600R@100MHz,350mA,0603: 500mÎ© Â±25% 600Î©@100MHz 0603 Ferrite Beads and Chips ROHS; Manufacturer 1: TAI-TECH; Manufacturer 1 Part Number: FCM1608KF-601T03; Vendor 1 Part Number: C141723; Vendor 1: LCSC; Part Name: FERRITE,600R@100MHz,350mA,0603; CreatedBy: Judd Foster; HelpURL: https://www.lcsc.com/datasheet/C141723.pdf
R19 = RES,6k81,0.1%,0.063W,0402: as R25 on sheet IGBT Current Control; Part Name: RES,6k81,0.1%,0.063W,0402; CreatedBy: Judd Foster; HelpURL: https://www.lcsc.com/datasheet/C851098.pdf; Value: 6k81
R20 = RES,1k,0.1%,0.063W,0402: as R3 on sheet IGBT Current Control; Part Name: RES,1k,0.1%,0.063W,0402; CreatedBy: Judd Foster; HelpURL: https://www.yageo.com/upload/media/product/app/datasheet/rchip/pyu-rt_1-to-0.01_rohs_l.pdf; Value: 1k
R165-R167 = RES,10k,5%,0.063W,0402: as R30 on sheet IGBT Current Control; Part Name: RES,10k,5%,0.063W,0402; CreatedBy: Judd Foster; HelpURL: https://www.seielect.com/catalog/sei-rmcf_rmcp.pdf; Value: 10k
U5 = DAC8830ID: 16 Bit Digital to Analog Converter 1 8-SOIC; Manufacturer 1: Texas Instruments; Vendor 1 Part Number: 296-21738-5-ND; Vendor 1: DigiKey; Part Name: DAC8830ID; CreatedBy: Judd Foster; HelpURL: https://www.ti.com/lit/ds/symlink/dac8830.pdf?HQS=dis-dk-null-digikeymode-dsf-pf-null-wwe&ts=1758462298577&ref_url=https%253A%252F%252Fwww.ti.com%252Fgeneral%252Fdocs%252Fsuppproductinfo.tsp%253FdistId%253D10%2526gotoUrl%253Dhttps%253A%252F%252Fwww.ti.com; Manufacturer 1 Part Number: DAC8830ID
U6 = REF3030AIDBZR: 3V ï¿½0.2% 3.05V~5.5V 25mA Fixed SOT-23 Voltage References ROHS; Manufacturer 1: Texas Instruments; Vendor 1 Part Number: C38423; Vendor 1: LCSC; Part Name: REF3030AIDBZR; CreatedBy: Judd Foster; HelpURL: https://www.ti.com/lit/ds/symlink/ref3030.pdf?ts=1702271215532&ref_url=https%253A%252F%252Fwww.ti.com%252Fproduct%252FREF3030%252Fpart-details%252FREF3030AIDBZR; Manufacturer 1 Part Number: REF3030AIDBZR
U9 = OPA2209AIDR: as U3 on sheet IGBT Current Control; Part Name: OPA2209AIDR; CreatedBy: Judd Foster; HelpURL: https://www.lcsc.com/datasheet/C2057330.pdf; Manufacturer 1 Part Number: OPA2209AIDR

## Sheet Voltage Sense.SchDoc
size 406 x 304 mm; SheetNumber: 8; SheetTotal: 14
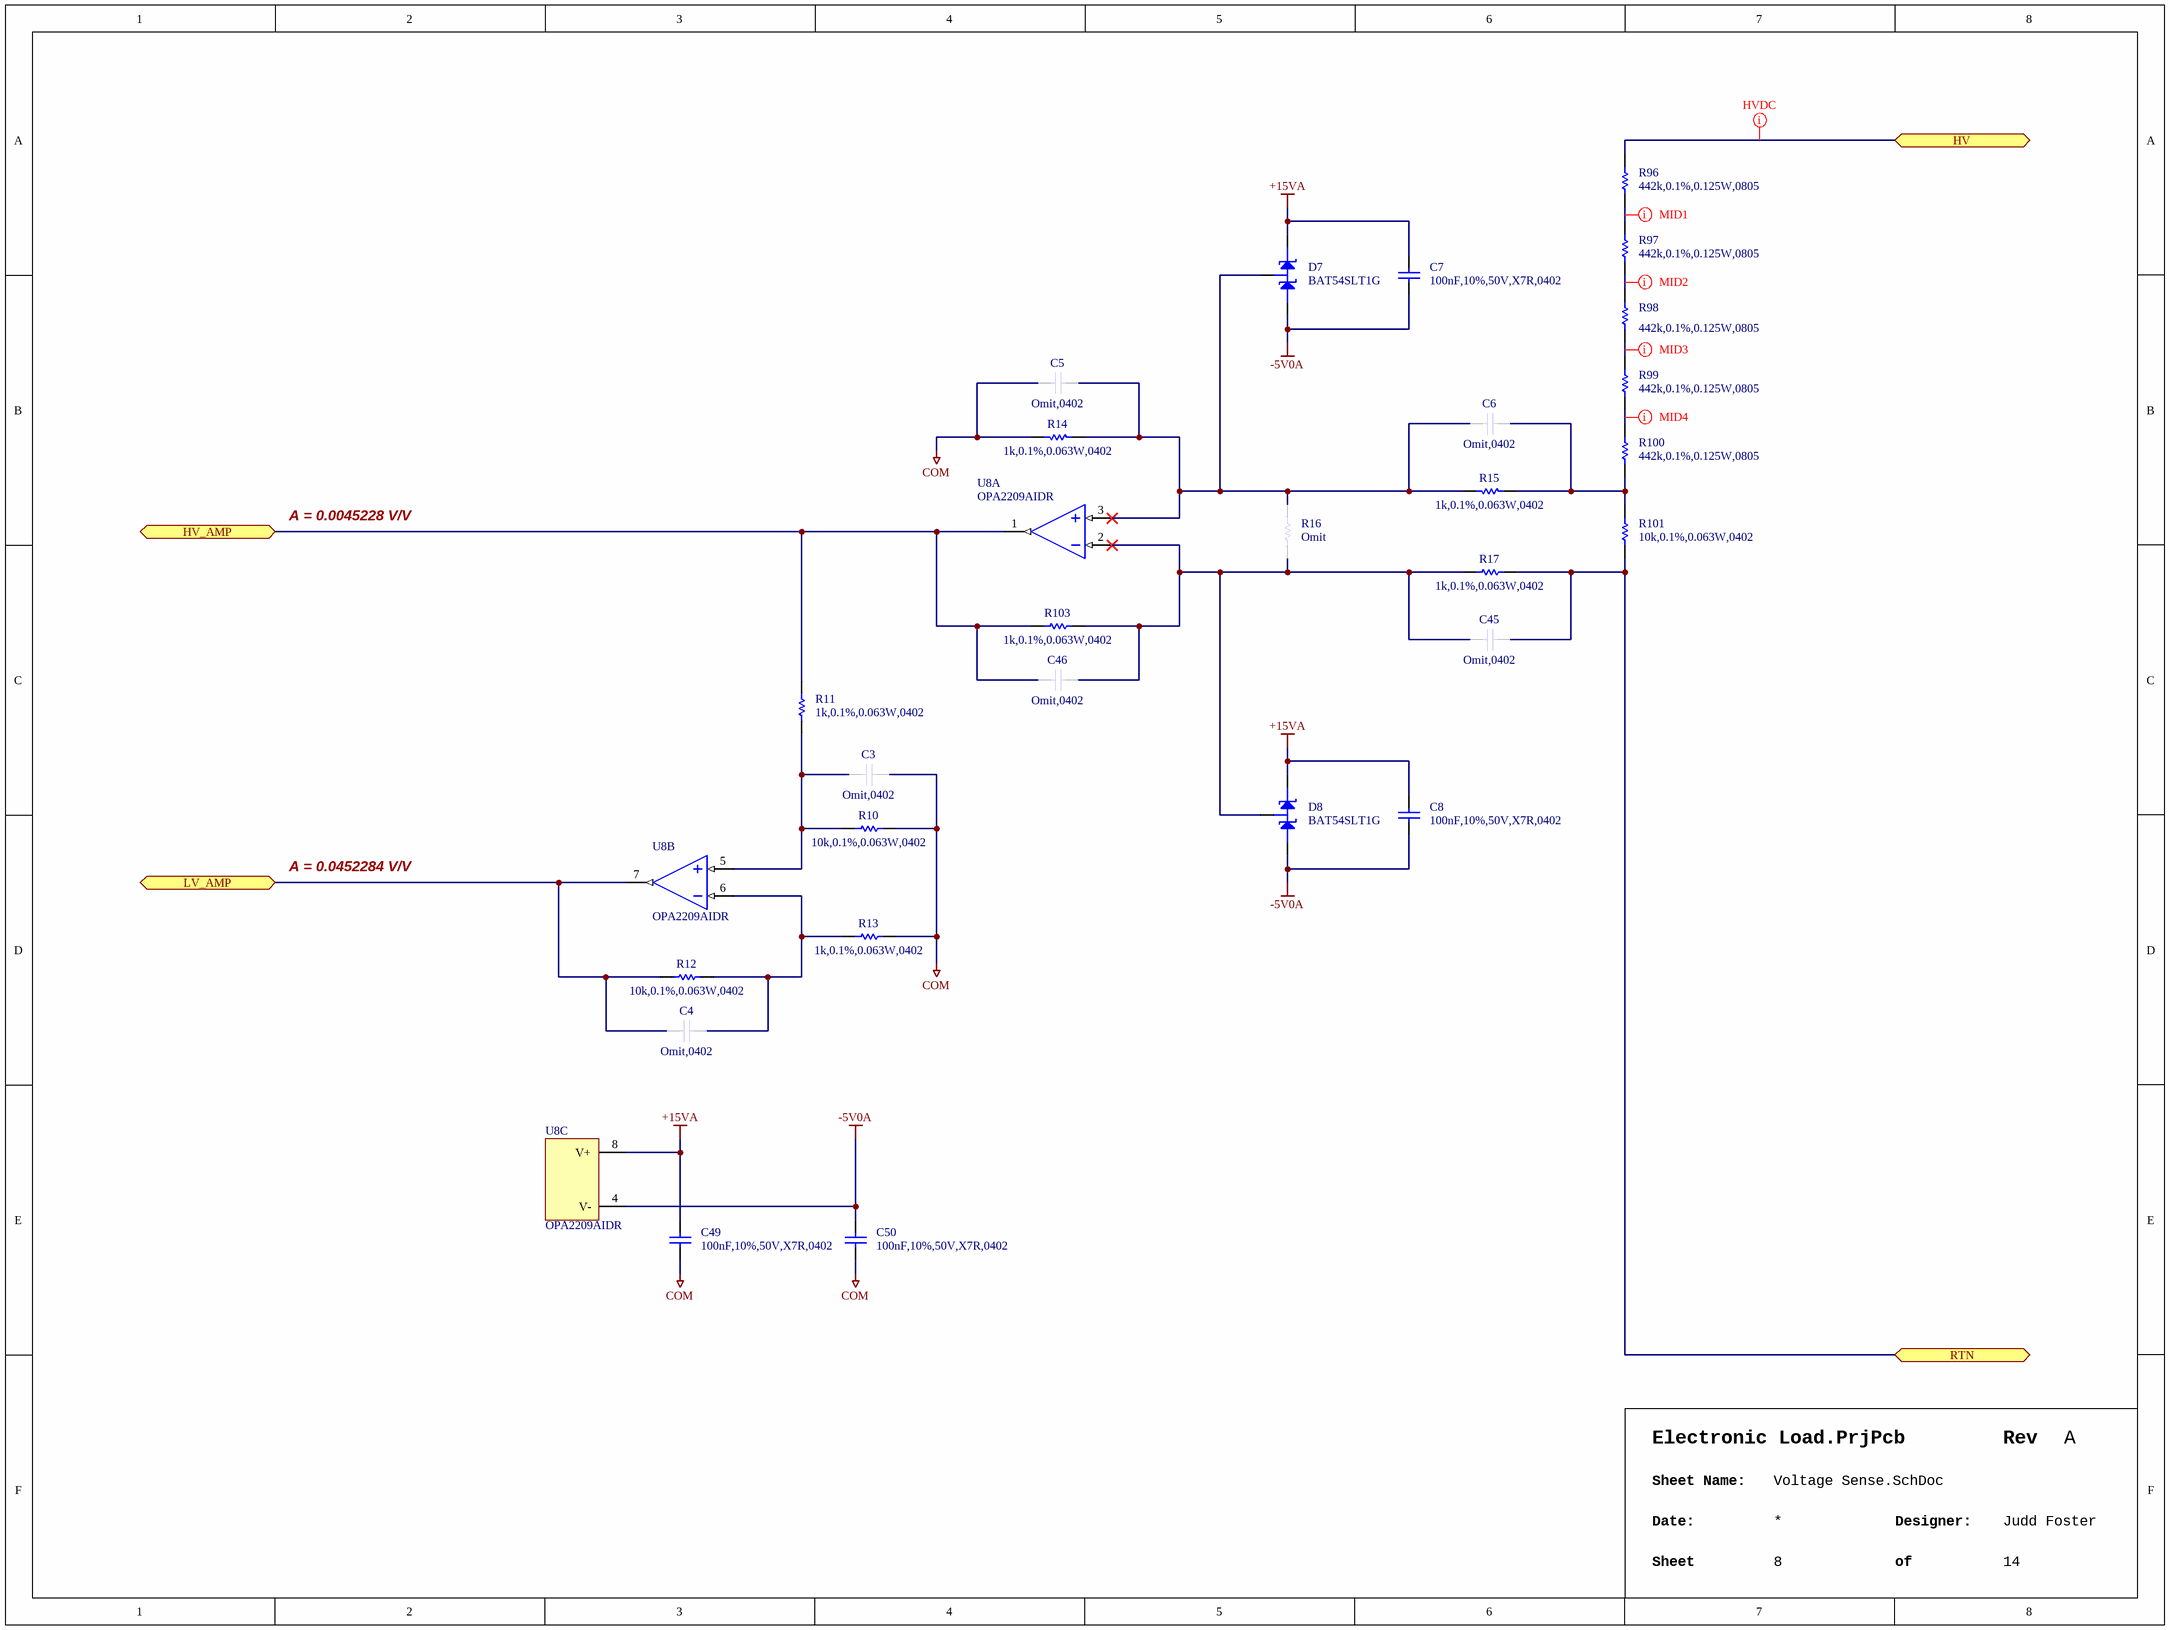
[diagram p7: Voltage Sense.SchDoc]

### Parts
C3  Omit,0402  [CAPC1005X06N]  (no BOM)
C4  Omit,0402  [CAPC1005X06N]  (no BOM)
C5  Omit,0402  [CAPC1005X06N]  (no BOM)
C6  Omit,0402  [CAPC1005X06N]  (no BOM)
C7  100nF,10%,50V,X7R,0402  [CAPC1005X06N]
C8  100nF,10%,50V,X7R,0402  [CAPC1005X06N]
C45  Omit,0402  [CAPC1005X06N]  (no BOM)
C46  Omit,0402  [CAPC1005X06N]  (no BOM)
C49  100nF,10%,50V,X7R,0402  [CAPC1005X06N]
C50  100nF,10%,50V,X7R,0402  [CAPC1005X06N]
D7  BAT54SLT1G  [SOT95P240X120-3N]
D8  BAT54SLT1G  [SOT95P240X120-3N]
R10  10k,0.1%,0.063W,0402  [RESC1005X04N]
R11  1k,0.1%,0.063W,0402  [RESC1005X04N]
R12  10k,0.1%,0.063W,0402  [RESC1005X04N]
R13  1k,0.1%,0.063W,0402  [RESC1005X04N]
R14  1k,0.1%,0.063W,0402  [RESC1005X04N]
R15  1k,0.1%,0.063W,0402  [RESC1005X04N]
R16  Omit  [RESC1005X04N]  (no BOM)
R17  1k,0.1%,0.063W,0402  [RESC1005X04N]
R96  442k,0.1%,0.125W,0805  [RESC2012X07N]
R97  442k,0.1%,0.125W,0805  [RESC2012X07N]
R98  442k,0.1%,0.125W,0805  [RESC2012X07N]
R99  442k,0.1%,0.125W,0805  [RESC2012X07N]
R100  442k,0.1%,0.125W,0805  [RESC2012X07N]
R101  10k,0.1%,0.063W,0402  [RESC1005X04N]
R103  1k,0.1%,0.063W,0402  [RESC1005X04N]
U8  OPA2209AIDR  [TEXASINSTRUMENTS_PKG_D0008A]  (parts A,B,C of 3)

### Ports
HV (bidir), HV_AMP (bidir), LV_AMP (bidir), RTN (bidir)

### Nets
+15VA: C7.2 C8.2 C49.2 D7.2(C) D8.2(C) U8.8(V+)
-5V0A: C7.1 C8.1 C50.2 D7.1(A) D8.1(A) U8.4(V-)
COM: C3.1 C5.1 C49.1 C50.1 R10.2 R13.1 R14.2
LOAD+: R96.2 ; port HV
LOAD-: C45.2 R17.1 R101.1 ; port RTN
NetC3_2: C3.2 R10.1 R11.2 U8.5(+INB)
NetC4_1: C4.1 R12.2 U8.7(OUTB) ; port LV_AMP
NetC4_2: C4.2 R12.1 R13.2 U8.6(-INB)
NetC5_2: C5.2 C6.1 D7.3(C/A) R14.1 R15.2 R16.2 U8.3(+INA)
NetC6_2: C6.2 R15.1 R100.1 R101.2
NetC45_1: C45.1 C46.2 D8.3(C/A) R16.1 R17.2 R103.1 U8.2(-INA)
NetC46_1: C46.1 R11.1 R103.2 U8.1(OUTA) ; port HV_AMP
NetR96_1: R96.1 R97.2
NetR97_1: R97.1 R98.2
NetR98_1: R98.1 R99.2
NetR99_1: R99.1 R100.2

### Layout directives
net class MID1: NetR96_1
net class HVDC: LOAD+
net class MID2: NetR97_1
net class MID3: NetR98_1
net class MID4: NetR99_1

### Notes on the sheet
- A = 0.0045228 V/V
- A = 0.0452284 V/V
- Rev
- Sheet Name:
- Date:
- Sheet
- Designer:
- of

### Library data of the parts
C3-C6 C45 C46 = CAP,Omit,0402: Omit; Part Name: CAP,Omit,0402; CreatedBy: Judd Foster; HelpURL: N/A; Manufacturer 1: N/A; Manufacturer 1 Part Number: N/A; Vendor 1: N/A; Vendor 1 Part Number: N/A; Value: Omit
C7 C8 C49 C50 = CAP,Cer,100nF,10%,50V,X7R,0402: as C15 on sheet IGBT Current Control; Part Name: CAP,Cer,100nF,10%,50V,X7R,0402; CreatedBy: Judd Foster; HelpURL: https://www.lcsc.com/datasheet/C77020.pdf
D7 D8 = DIODE,Array,Schottky,Series,30V,200mA,SOT23: Diode Array 1 Pair Series Connection 30 V 200mA (DC) Surface Mount TO-236-3, SC-59, SOT-23-3; Manufacturer 1: onsemi; Vendor 1 Part Number: BAT54SLT1GOSCT-ND; Vendor 1: Digikey; Part Name: DIODE,Array,Schottky,Series,30V,200mA,SOT23; CreatedBy: Judd Foster; HelpURL: https://www.onsemi.com/pdf/datasheet/bat54slt1-d.pdf; Manufacturer 1 Part Number: BAT54SLT1G
R10 R12 R101 = RES,10k,0.1%,0.063W,0402: 10 kOhms ï¿½0.1% 0.1W, 1/10W Chip Resistor 0402 (1005 Metric) Automotive AEC-Q200 Thin Film; Manufacturer 1: Stackpole Electronics Inc; Manufacturer 1 Part Number: RNCF0402BTE10K0; Vendor 1 Part Number: RNCF0402BTE10K0CT-ND; Vendor 1: Digikey; Part Name: RES,10k,0.1%,0.063W,0402; CreatedBy: Judd Foster; HelpURL: https://www.seielect.com/catalog/sei-rncf.pdf; Value: 10k
R11 R13-R15 R17 R103 = RES,1k,0.1%,0.063W,0402: as R3 on sheet IGBT Current Control; Part Name: RES,1k,0.1%,0.063W,0402; CreatedBy: Judd Foster; HelpURL: https://www.yageo.com/upload/media/product/app/datasheet/rchip/pyu-rt_1-to-0.01_rohs_l.pdf; Value: 1k
R16 = RES,Omit,0402: Part Name: RES,Omit,0402; CreatedBy: Judd Foster; HelpURL: N/A; Manufacturer 1: N/A; Manufacturer 1 Part Number: N/A; Vendor 1: N/A; Vendor 1 Part Number: N/A; Value: Omit
R96-R100 = RES,442k,0.1%,0.125W,0805: 442 kOhms Â±0.1% 0.125W, 1/8W Chip Resistor 0805 (2012 Metric) Automotive AEC-Q200 Thin Film; Manufacturer 1: Panasonic Electronic Components; Manufacturer 1 Part Number: ERA-6AEB4423V; Vendor 1 Part Number: P442KDACT-ND; Vendor 1: DigiKey; Part Name: RES,442k,0.1%,0.125W,0805; CreatedBy: Judd Foster; HelpURL: https://industrial.panasonic.com/cdbs/www-data/pdf/RDM0000/AOA0000C307.pdf; Value: 442k
U8 = OPA2209AIDR: as U3 on sheet IGBT Current Control; Part Name: OPA2209AIDR; CreatedBy: Judd Foster; HelpURL: https://www.lcsc.com/datasheet/C2057330.pdf; Manufacturer 1 Part Number: OPA2209AIDR

## Sheet Clamp Top.SchDoc
size 406 x 304 mm; SheetNumber: 9; SheetTotal: 14
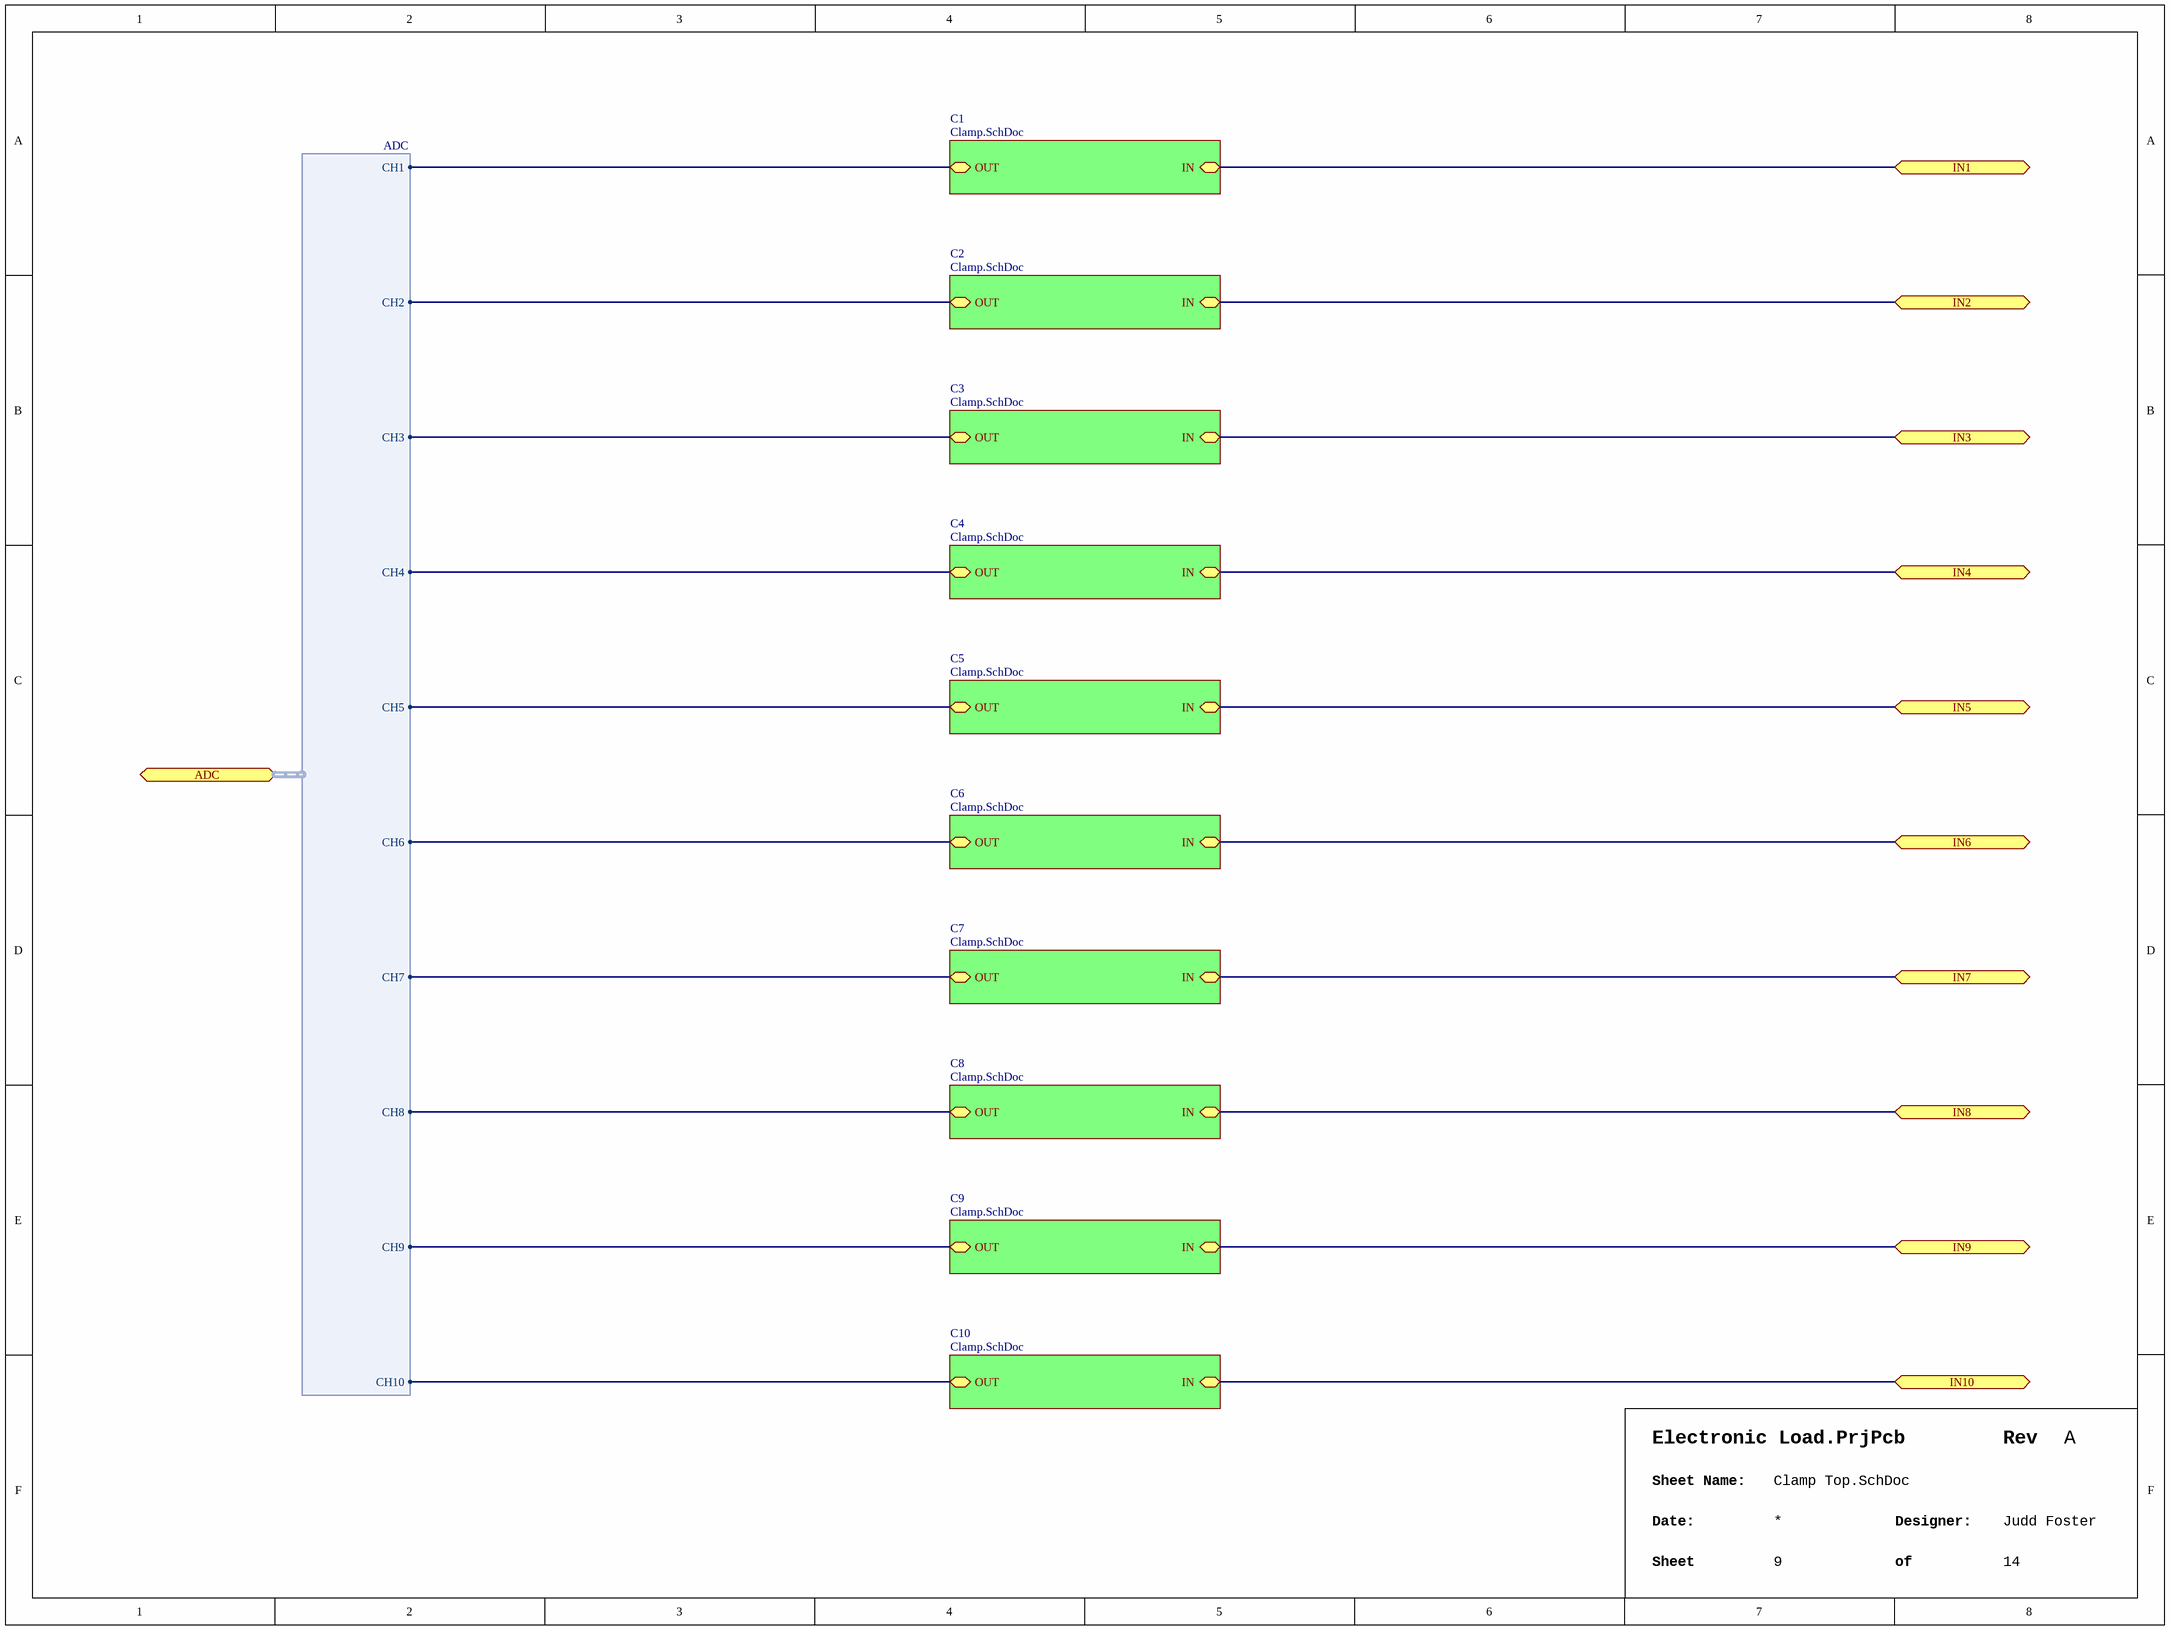
[diagram p8: Clamp Top.SchDoc]

### Sub-sheets
C1 = Clamp.SchDoc: IN (bidir), OUT (bidir)
C2 = Clamp.SchDoc: IN (bidir), OUT (bidir)
C3 = Clamp.SchDoc: IN (bidir), OUT (bidir)
C4 = Clamp.SchDoc: IN (bidir), OUT (bidir)
C5 = Clamp.SchDoc: IN (bidir), OUT (bidir)
C6 = Clamp.SchDoc: IN (bidir), OUT (bidir)
C7 = Clamp.SchDoc: IN (bidir), OUT (bidir)
C8 = Clamp.SchDoc: IN (bidir), OUT (bidir)
C9 = Clamp.SchDoc: IN (bidir), OUT (bidir)
C10 = Clamp.SchDoc: IN (bidir), OUT (bidir)

### Ports
ADC (bidir, harness ADC), IN1 (bidir), IN2 (bidir), IN3 (bidir), IN4 (bidir), IN5 (bidir), IN6 (bidir), IN7 (bidir), IN8 (bidir), IN9 (bidir), IN10 (bidir)

### Harnesses
ADC: CH10, CH1, CH2, CH3, CH4, CH5, CH6, CH7, CH8, CH9

### Nets
ADC.CH1: sheet C1/OUT, port ADC.CH1
ADC.CH2: sheet C2/OUT, port ADC.CH2
ADC.CH3: sheet C3/OUT, port ADC.CH3
ADC.CH4: sheet C4/OUT, port ADC.CH4
ADC.CH5: sheet C5/OUT, port ADC.CH5
ADC.CH6: sheet C6/OUT, port ADC.CH6
ADC.CH7: sheet C7/OUT, port ADC.CH7
ADC.CH8: sheet C8/OUT, port ADC.CH8
ADC.CH9: sheet C9/OUT, port ADC.CH9
ADC.CH10: sheet C10/OUT, port ADC.CH10
NetC1_CLG_CL1_ICC_2: port IN1, sheet C1/IN
NetC1_CLG_CL2_ICC_2: port IN2, sheet C2/IN
NetC1_CLG_CL3_ICC_2: port IN3, sheet C3/IN
NetC1_CLG_CL4_ICC_2: port IN4, sheet C4/IN
NetC1_CLG_CL5_ICC_2: port IN5, sheet C5/IN
NetC1_CLG_CL6_ICC_2: port IN6, sheet C6/IN
NetC1_CLG_CL7_ICC_2: port IN7, sheet C7/IN
NetC1_CLG_CL8_ICC_2: port IN8, sheet C8/IN
NetC4_1: port IN9, sheet C9/IN
NetC46_1: port IN10, sheet C10/IN

### Notes on the sheet
- Rev
- Sheet Name:
- Date:
- Sheet
- Designer:
- of

## Sheet Clamp.SchDoc
size 406 x 304 mm; SheetNumber: 14; SheetTotal: 18
Used 10 times, as channels CLG/CT/C1, CLG/CT/C2, CLG/CT/C3, CLG/CT/C4, CLG/CT/C5, CLG/CT/C6, CLG/CT/C7, CLG/CT/C8, CLG/CT/C9, CLG/CT/C10. Parts and nets are listed once, with the designators drawn on the sheet.
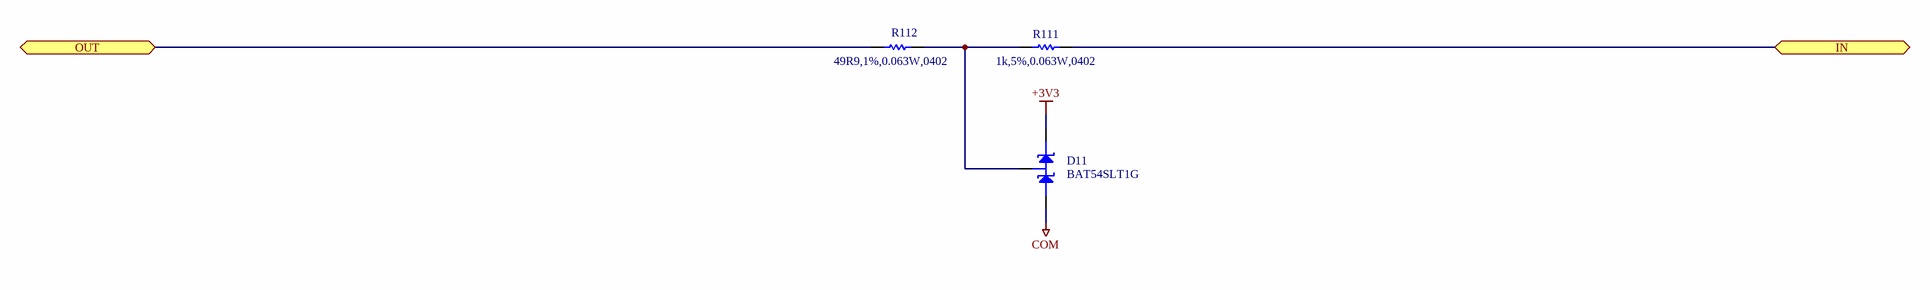
[diagram p9: Clamp.SchDoc]

### Parts
D11  BAT54SLT1G  [SOT95P240X120-3N]
R111  1k,5%,0.063W,0402  [RESC1005X04N]
R112  49R9,1%,0.063W,0402  [RESC1005X04N]

### Ports
IN (bidir), OUT (bidir)

### Nets
+3V3: D11.2(C)
COM: D11.1(A)
IN: R111.2 ; port IN
OUT: R112.1 ; port OUT
NetD11_3: D11.3(C/A) R111.1 R112.2

### Channels
CLG/CT/C1: designators end in _C1; ports IN=NetC1_CLG_CL1_ICC_2 OUT=ADC.CH1
CLG/CT/C2: designators end in _C2; ports IN=NetC1_CLG_CL2_ICC_2 OUT=ADC.CH2
CLG/CT/C3: designators end in _C3; ports IN=NetC1_CLG_CL3_ICC_2 OUT=ADC.CH3
CLG/CT/C4: designators end in _C4; ports IN=NetC1_CLG_CL4_ICC_2 OUT=ADC.CH4
CLG/CT/C5: designators end in _C5; ports IN=NetC1_CLG_CL5_ICC_2 OUT=ADC.CH5
CLG/CT/C6: designators end in _C6; ports IN=NetC1_CLG_CL6_ICC_2 OUT=ADC.CH6
CLG/CT/C7: designators end in _C7; ports IN=NetC1_CLG_CL7_ICC_2 OUT=ADC.CH7
CLG/CT/C8: designators end in _C8; ports IN=NetC1_CLG_CL8_ICC_2 OUT=ADC.CH8
CLG/CT/C9: designators end in _C9; ports IN=NetC4_1 OUT=ADC.CH9
CLG/CT/C10: designators end in _C10; ports IN=NetC46_1 OUT=ADC.CH10

### Notes on the sheet
- Rev
- Sheet Name:
- Date:
- Sheet
- Designer:
- of

### Library data of the parts
D11 = DIODE,Array,Schottky,Series,30V,200mA,SOT23: as D7 on sheet Voltage Sense; Part Name: DIODE,Array,Schottky,Series,30V,200mA,SOT23; CreatedBy: Judd Foster; HelpURL: https://www.onsemi.com/pdf/datasheet/bat54slt1-d.pdf; Manufacturer 1 Part Number: BAT54SLT1G
R111 = RES,1k,5%,0.063W,0402: as R83 on sheet Pass Transistor; Part Name: RES,1k,5%,0.063W,0402; CreatedBy: Judd Foster; HelpURL: https://www.seielect.com/catalog/sei-rmcf_rmcp.pdf; Value: 1k
R112 = RES,49R9,1%,0.063W,0402: 49.9 Ohms Â±1% 0.063W, 1/16W Chip Resistor 0402 (1005 Metric) Moisture Resistant Thick Film; Manufacturer 1: YAGEO; Manufacturer 1 Part Number: RC0402FR-0749R9L; Vendor 1 Part Number: 311-49.9LRCT-ND; Vendor 1: DigiKey; Value: 49.9; Part Name: RES,49R9,1%,0.063W,0402; CreatedBy: Judd Foster; HelpURL: https://www.yageo.com/upload/media/product/products/datasheet/rchip/PYu-RC_Group_51_RoHS_L_12.pdf

## Sheet MCU.SchDoc
size 406 x 304 mm; SheetNumber: 11; SheetTotal: 14
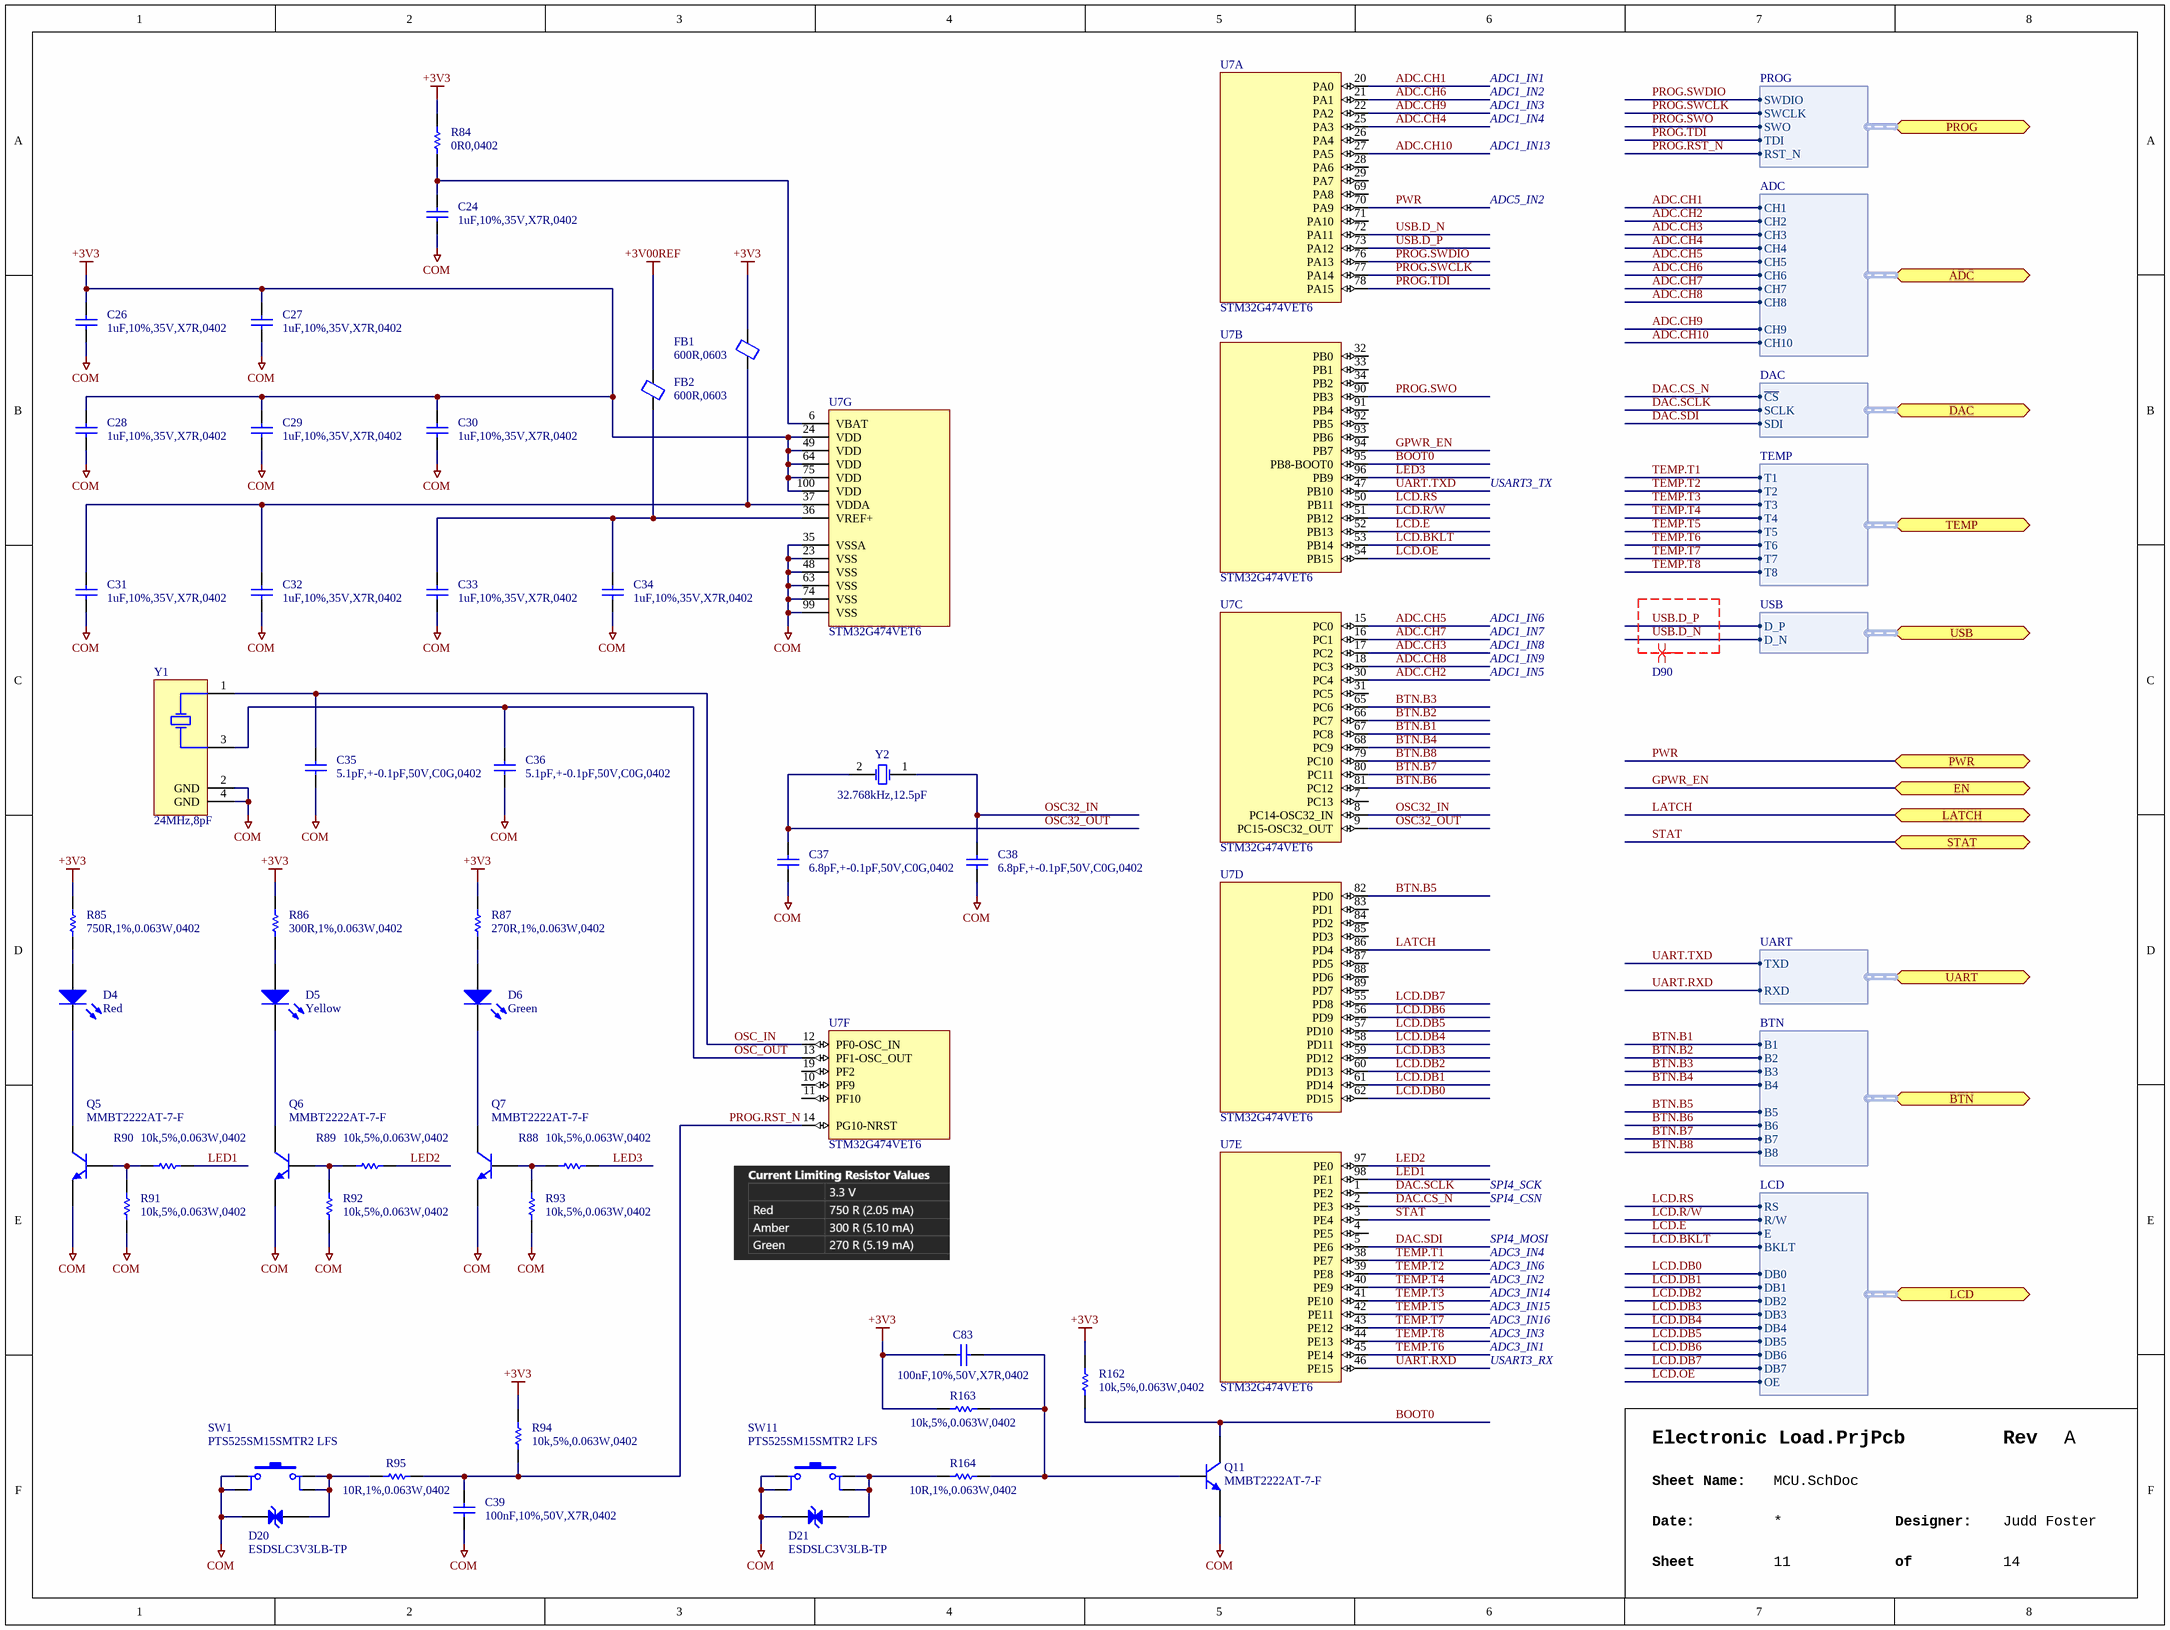
[diagram p10: MCU.SchDoc]

### Parts
C24  1uF,10%,35V,X7R,0402  [CAPC1005X06N]
C26  1uF,10%,35V,X7R,0402  [CAPC1005X06N]
C27  1uF,10%,35V,X7R,0402  [CAPC1005X06N]
C28  1uF,10%,35V,X7R,0402  [CAPC1005X06N]
C29  1uF,10%,35V,X7R,0402  [CAPC1005X06N]
C30  1uF,10%,35V,X7R,0402  [CAPC1005X06N]
C31  1uF,10%,35V,X7R,0402  [CAPC1005X06N]
C32  1uF,10%,35V,X7R,0402  [CAPC1005X06N]
C33  1uF,10%,35V,X7R,0402  [CAPC1005X06N]
C34  1uF,10%,35V,X7R,0402  [CAPC1005X06N]
C35  5.1pF,+-0.1pF,50V,C0G,0402  [CAPC1005X06N]
C36  5.1pF,+-0.1pF,50V,C0G,0402  [CAPC1005X06N]
C37  6.8pF,+-0.1pF,50V,C0G,0402  [CAPC1005X06N]
C38  6.8pF,+-0.1pF,50V,C0G,0402  [CAPC1005X06N]
C39  100nF,10%,50V,X7R,0402  [CAPC1005X06N]
C83  100nF,10%,50V,X7R,0402  [CAPC1005X06N]
D4  Red  [LITE-ON_LTST-C190KRKT]
D5  Yellow  [LITE-ON_LTST-C190KSKT]
D6  Green  [LITE-ON_LTST-C190KGKT]
D20  ESDSLC3V3LB-TP  [DFN65P100X50-2N]
D21  ESDSLC3V3LB-TP  [DFN65P100X50-2N]
FB1  600R,0603  [INDC_0603]
FB2  600R,0603  [INDC_0603]
Q5  MMBT2222AT-7-F  [SOTFL50P160X90-3N]
Q6  MMBT2222AT-7-F  [SOTFL50P160X90-3N]
Q7  MMBT2222AT-7-F  [SOTFL50P160X90-3N]
Q11  MMBT2222AT-7-F  [SOTFL50P160X90-3N]
R84  0R0,0402  [RESC1005X04N]
R85  750R,1%,0.063W,0402  [RESC1005X04N]
R86  300R,1%,0.063W,0402  [RESC1005X04N]
R87  270R,1%,0.063W,0402  [RESC1005X04N]
R88  10k,5%,0.063W,0402  [RESC1005X04N]
R89  10k,5%,0.063W,0402  [RESC1005X04N]
R90  10k,5%,0.063W,0402  [RESC1005X04N]
R91  10k,5%,0.063W,0402  [RESC1005X04N]
R92  10k,5%,0.063W,0402  [RESC1005X04N]
R93  10k,5%,0.063W,0402  [RESC1005X04N]
R94  10k,5%,0.063W,0402  [RESC1005X04N]
R95  10R,1%,0.063W,0402  [RESC1005X04N]
R162  10k,5%,0.063W,0402  [RESC1005X04N]
R163  10k,5%,0.063W,0402  [RESC1005X04N]
R164  10R,1%,0.063W,0402  [RESC1005X04N]
SW1  PTS525SM15SMTR2 LFS  [C&K_PTS525SM15SMTR2 LFS]
SW11  PTS525SM15SMTR2 LFS  [C&K_PTS525SM15SMTR2 LFS]
U7  STM32G474VET6  [STMICROELECTRONICS_PKG_LQFP100]  (parts A,B,C,D,E,F,G of 7)
Y1  24MHz,8pF  [NDK_NX2016SA]
Y2  32.768kHz,12.5pF  [EPSON_FC-135]

### Ports
ADC (bidir, harness ADC), BTN (bidir, harness BTN), DAC (bidir, harness DAC), EN (bidir), LATCH (bidir), LCD (bidir, harness LCD), PROG (bidir, harness PROG), PWR (bidir), STAT (bidir), TEMP (bidir, harness TEMP), UART (bidir, harness UART), USB (bidir, harness USB)

### Harnesses
ADC: CH10, CH1, CH2, CH3, CH4, CH5, CH6, CH7, CH8, CH9
DAC: SDI, SCLK, ~{CS}
TEMP: T1, T2, T3, T4, T5, T6, T7, T8
USB: D_P, D_N
LCD: RS, R/W, E, BKLT, DB0, DB1, DB2, DB3, DB4, DB5, DB6, DB7, OE
BTN: B1, B2, B3, B4, B5, B6, B7, B8
UART: TXD, RXD
PROG: SWDIO, SWCLK, SWO, TDI, RST_N

### Nets
+3V00REF: FB2.2
+3V3: C26.2 C27.2 C28.2 C29.2 C30.2 C83.2 FB1.2 R84.2 R85.2 R86.2 R87.2 R94.2 R162.1 R163.2 U7.24(VDD) U7.49(VDD) U7.64(VDD) U7.75(VDD) U7.100(VDD)
COM: C24.1 C26.1 C27.1 C28.1 C29.1 C30.1 C31.1 C32.1 C33.1 C34.1 C35.1 C36.1 C37.1 C38.1 C39.1 D20.1(K) D21.1(K) Q5.2(E) Q6.2(E) Q7.2(E) Q11.2(E) R91.1 R92.1 R93.1 SW1.1 SW1.2 SW11.1 SW11.2 U7.23(VSS) U7.35(VSSA) U7.48(VSS) U7.63(VSS) U7.74(VSS) U7.99(VSS) Y1.2(GND) Y1.4(GND)
ADC.CH1: U7.20(PA0) ; port ADC.CH1
ADC.CH2: U7.30(PC4) ; port ADC.CH2
ADC.CH3: U7.17(PC2) ; port ADC.CH3
ADC.CH4: U7.25(PA3) ; port ADC.CH4
ADC.CH5: U7.15(PC0) ; port ADC.CH5
ADC.CH6: U7.21(PA1) ; port ADC.CH6
ADC.CH7: U7.16(PC1) ; port ADC.CH7
ADC.CH8: U7.18(PC3) ; port ADC.CH8
ADC.CH9: U7.22(PA2) ; port ADC.CH9
ADC.CH10: U7.27(PA5) ; port ADC.CH10
BOOT0: Q11.3(C) R162.2 U7.95(PB8-BOOT0)
BTN.B1: U7.67(PC8) ; port BTN.B1
BTN.B2: U7.66(PC7) ; port BTN.B2
BTN.B3: U7.65(PC6) ; port BTN.B3
BTN.B4: U7.68(PC9) ; port BTN.B4
BTN.B5: U7.82(PD0) ; port BTN.B5
BTN.B6: U7.81(PC12) ; port BTN.B6
BTN.B7: U7.80(PC11) ; port BTN.B7
BTN.B8: U7.79(PC10) ; port BTN.B8
DAC.CS_N: U7.2(PE3) ; port DAC.~{CS}
DAC.SCLK: U7.1(PE2) ; port DAC.SCLK
DAC.SDI: U7.5(PE6) ; port DAC.SDI
GPWR_EN: U7.94(PB7) ; port EN
LATCH: U7.86(PD4) ; port LATCH
LCD.BKLT: U7.53(PB14) ; port LCD.BKLT
LCD.DB0: U7.62(PD15) ; port LCD.DB0
LCD.DB1: U7.61(PD14) ; port LCD.DB1
LCD.DB2: U7.60(PD13) ; port LCD.DB2
LCD.DB3: U7.59(PD12) ; port LCD.DB3
LCD.DB4: U7.58(PD11) ; port LCD.DB4
LCD.DB5: U7.57(PD10) ; port LCD.DB5
LCD.DB6: U7.56(PD9) ; port LCD.DB6
LCD.DB7: U7.55(PD8) ; port LCD.DB7
LCD.E: U7.52(PB13) ; port LCD.E
LCD.OE: U7.54(PB15) ; port LCD.OE
LCD.R/W: U7.51(PB12) ; port LCD.R/W
LCD.RS: U7.50(PB11) ; port LCD.RS
LED1: R90.1 U7.98(PE1)
LED2: R89.1 U7.97(PE0)
LED3: R88.1 U7.96(PB9)
OSC32_IN: C38.2 U7.8(PC14-OSC32_IN) Y2.1(OSC1)
OSC32_OUT: C37.2 U7.9(PC15-OSC32_OUT) Y2.2(GND)
OSC_IN: C35.2 U7.12(PF0-OSC_IN) Y1.1(OSC1)
OSC_OUT: C36.2 U7.13(PF1-OSC_OUT) Y1.3(OSC2)
PROG.RST_N: C39.2 R94.1 R95.2 U7.14(PG10-NRST) ; port PROG.RST_N
PROG.SWCLK: U7.77(PA14) ; port PROG.SWCLK
PROG.SWDIO: U7.76(PA13) ; port PROG.SWDIO
PROG.SWO: U7.90(PB3) ; port PROG.SWO
PROG.TDI: U7.78(PA15) ; port PROG.TDI
PWR: U7.70(PA9) ; port PWR
STAT: U7.3(PE4) ; port STAT
TEMP.T1: U7.38(PE7) ; port TEMP.T1
TEMP.T2: U7.39(PE8) ; port TEMP.T2
TEMP.T3: U7.41(PE10) ; port TEMP.T3
TEMP.T4: U7.40(PE9) ; port TEMP.T4
TEMP.T5: U7.42(PE11) ; port TEMP.T5
TEMP.T6: U7.45(PE14) ; port TEMP.T6
TEMP.T7: U7.43(PE12) ; port TEMP.T7
TEMP.T8: U7.44(PE13) ; port TEMP.T8
UART.RXD: U7.46(PE15) ; port UART.RXD
UART.TXD: U7.47(PB10) ; port UART.TXD
USB.D_N: U7.72(PA11) ; port USB.D_N
USB.D_P: U7.73(PA12) ; port USB.D_P
NetC24_2: C24.2 R84.1 U7.6(VBAT)
NetC31_2: C31.2 C32.2 FB1.1 U7.37(VDDA)
NetC33_2: C33.2 C34.2 FB2.1 U7.36(VREF+)
NetC83_1: C83.1 Q11.1(B) R163.1 R164.2
NetD4_A: D4.A R85.1
NetD4_C: D4.C Q5.3(C)
NetD5_A: D5.A R86.1
NetD5_C: D5.C Q6.3(C)
NetD6_A: D6.A R87.1
NetD6_C: D6.C Q7.3(C)
NetD20_2: D20.2(A) R95.1 SW1.3 SW1.4
NetD21_2: D21.2(A) R164.1 SW11.3 SW11.4
NetQ5_1: Q5.1(B) R90.2 R91.2
NetQ6_1: Q6.1(B) R89.2 R92.2
NetQ7_1: Q7.1(B) R88.2 R93.2

Not connected (* = marked no-connect by the designer): U7 4(PE5) 7(PC13) 10(PF9) 11(PF10) 19(PF2) 26(PA4) 28(PA6) 29(PA7) 31(PC5) 32(PB0) 33(PB1) 34(PB2) 69(PA8) 71(PA10) 83(PD1) 84(PD2) 85(PD3) 87(PD5) 88(PD6) 89(PD7) 91(PB4) 92(PB5) 93(PB6)

### Layout directives
differential pair; differential pair class D90: USB.D_N, USB.D_P

### Notes on the sheet
- ADC1_IN1
- ADC1_IN2
- ADC1_IN3
- ADC1_IN4
- ADC1_IN13
- ADC5_IN2
- USART3_TX
- ADC1_IN6
- ADC1_IN7
- ADC1_IN5
- ADC1_IN8
- ADC1_IN9
- SPI4_SCK
- SPI4_CSN
- SPI4_MOSI
- ADC3_IN4
- ADC3_IN6
- ADC3_IN2
- ADC3_IN14
- ADC3_IN15
- ADC3_IN16
- ADC3_IN3
- ADC3_IN1
- USART3_RX
- Rev
- Sheet Name:
- Date:
- Sheet
- Designer:
- of

### Library data of the parts
C24 C26-C34 = CAP,Cer,1uF,35VDC,X5R,0402: as C21 on sheet DAC; Part Name: CAP,Cer,1uF,35VDC,X5R,0402; CreatedBy: Judd Foster; HelpURL: https://product.tdk.com/info/en/catalog/datasheets/mlcc_commercial_general_en.pdf?ref_disty=digikey
C35 C36 = CAP,Cer,5.1pF,+-0.1pF,50V,C0G,0402: 50V 5.1pF C0G 0402 Ceramic Capacitors ROHS; Manufacturer 1: Murata; Manufacturer 1 Part Number: GJM1555C1H5R1BB01D; Vendor 1 Part Number: C237535; Vendor 1: LCSC; Value: 5.1p; Part Name: CAP,Cer,5.1pF,+-0.1pF,50V,C0G,0402; CreatedBy: Judd Foster; HelpURL: https://www.lcsc.com/datasheet/C237535.pdf
C37 C38 = CAP,Cer,6.8pF,+-0.1pF,50V,C0G,0402: 50V 6.8pF C0G 0402 Ceramic Capacitors ROHS; Manufacturer 1: Murata; Manufacturer 1 Part Number: GJM1555C1H6R8BB01D; Vendor 1 Part Number: C88896; Vendor 1: LCSC; Value: 6.8p; Part Name: CAP,Cer,6.8pF,+-0.1pF,50V,C0G,0402; CreatedBy: Judd Foster; HelpURL: https://www.lcsc.com/datasheet/C88896.pdf
C39 C83 = CAP,Cer,100nF,10%,50V,X7R,0402: as C15 on sheet IGBT Current Control; Part Name: CAP,Cer,100nF,10%,50V,X7R,0402; CreatedBy: Judd Foster; HelpURL: https://www.lcsc.com/datasheet/C77020.pdf
D4 = LED,Red,SMD,0603: Red 631nm LED Indication - Discrete 2V 0603 (1608 Metric); Manufacturer 1: Lite-On Inc.; Manufacturer 1 Part Number: LTST-C190KRKT; Vendor 1 Part Number: 160-1436-1-ND; Vendor 1: Digikey; Part Name: LED,Red,SMD,0603; CreatedBy: Judd Foster; HelpURL: https://optoelectronics.liteon.com/upload/download/DS-22-99-0151/LTST-C190KRKT.pdf; Value: Red
D5 = LED,Yellow,SMD,0603: Yellow 591nm LED Indication - Discrete 2.1V 0603 (1608 Metric); Manufacturer 1: Lite-On Inc.; Manufacturer 1 Part Number: LTST-C190KSKT; Vendor 1 Part Number: 160-1437-1-ND; Vendor 1: Digikey; Part Name: LED,Yellow,SMD,0603; CreatedBy: Judd Foster; HelpURL: https://optoelectronics.liteon.com/upload/download/DS-22-99-0189/LTST-C190KSKT.pdf; Value: Yellow
D6 = LED,Green,SMD,0603: Green 571nm LED Indication - Discrete 2V 0603 (1608 Metric); Manufacturer 1: Lite-On Inc.; Manufacturer 1 Part Number: LTST-C190KGKT; Vendor 1 Part Number: 160-1435-1-ND; Vendor 1: Digikey; Part Name: LED,Green,SMD,0603; CreatedBy: Judd Foster; HelpURL: https://optoelectronics.liteon.com/upload/download/DS22-2000-074/LTST-C190KGKT.PDF; Value: Green
D20 D21 = DIODE,TVS,3.3V,SOD882: 20V Clamp 5A (8/20ï¿½s) Ipp Tvs Diode Surface Mount DFN1006-2; Manufacturer 1: Micro Commercial Co; Vendor 1 Part Number: ESDSLC3V3LB-TPMSCT-ND; Vendor 1: Digikey; Part Name: DIODE,TVS,3.3V,SOD882; CreatedBy: Judd Foster; HelpURL: https://www.mccsemi.com/pdf/Products/ESDSLC3V3LB(DFN1006-2).pdf; Manufacturer 1 Part Number: ESDSLC3V3LB-TP
FB1 FB2 = FERRITE,600R@100MHz,350mA,0603: as FB5 on sheet DAC; Part Name: FERRITE,600R@100MHz,350mA,0603; CreatedBy: Judd Foster; HelpURL: https://www.lcsc.com/datasheet/C141723.pdf
Q5-Q7 Q11 = Trans,NPN,40V,600mA,SOT523: Bipolar (BJT) Transistor NPN 40 V 600 mA 300MHz 150 mW Surface Mount SOT-523; Manufacturer 1: Diodes Incorporated; Vendor 1 Part Number: MMBT2222AT-FDICT-ND; Vendor 1: Digikey; Part Name: Trans,NPN,40V,600mA,SOT523; CreatedBy: Judd Foster; HelpURL: https://media.digikey.com/pdf/Data%20Sheets/Diodes%20PDFs/MMBT2222AT_Rev2016.pdf; Manufacturer 1 Part Number: MMBT2222AT-7-F
R84 = RES,0R0,0402: as R1 on sheet IGBT Current Control; Part Name: RES,0R0,0402; CreatedBy: Judd Foster; HelpURL: https://industrial.panasonic.com/cdbs/www-data/pdf/RDA0000/AOA0000C301.pdf
R85 = RES,750R,1%,0.063W,0402: 750Î© 62.5mW 50V Â±100ppm/â„ƒ Thick Film Resistor Â±1% 0402 Chip Resistor - Surface Mount ROHS; Manufacturer 1: UNI-ROYAL; Manufacturer 1 Part Number: 0402WGF7500TCE; Vendor 1 Part Number: C25132; Vendor 1: LCSC; Part Name: RES,750R,1%,0.063W,0402; CreatedBy: Judd Foster; HelpURL: https://www.lcsc.com/datasheet/C25132.pdf
R86 = RES,300R,1%,0.063W,0402: 300Î© 62.5mW 50V Â±100ppm/â„ƒ Thick Film Resistor Â±1% 0402 Chip Resistor - Surface Mount ROHS; Manufacturer 1: UNI-ROYAL; Manufacturer 1 Part Number: 0402WGF3000TCE; Vendor 1 Part Number: C25102; Vendor 1: LCSC; Part Name: RES,300R,1%,0.063W,0402; CreatedBy: Judd Foster; HelpURL: https://www.lcsc.com/datasheet/C25102.pdf
R87 = RES,270R,1%,0.063W,0402: 62.5mW Thick Film Resistor 50V Â±100ppm/â„ƒ Â±1% 270Î© 0402 Chip Resistor - Surface Mount ROHS; Manufacturer 1: YAGEO; Manufacturer 1 Part Number: RC0402FR-07270RL; Vendor 1 Part Number: C163474; Vendor 1: LCSC; Value: 270; Part Name: RES,270R,1%,0.063W,0402; CreatedBy: Judd Foster; HelpURL: https://www.lcsc.com/datasheet/C163474.pdf
R88-R94 R162 R163 = RES,10k,5%,0.063W,0402: as R30 on sheet IGBT Current Control; Part Name: RES,10k,5%,0.063W,0402; CreatedBy: Judd Foster; HelpURL: https://www.seielect.com/catalog/sei-rmcf_rmcp.pdf; Value: 10k
R95 R164 = RES,10R,1%,0.063W,0402: as R18 on sheet Pass Transistor; Part Name: RES,10R,1%,0.063W,0402; CreatedBy: Judd Foster; HelpURL: https://industrial.panasonic.com/cdbs/www-data/pdf/RDA0000/AOA0000C304.pdf
SW1 SW11 = Switch,Tactile,SPST-NO,SMD,H1.5: Tactile Switch SPST-NO Top Actuated Surface Mount; Manufacturer 1: C&K; Vendor 1 Part Number: CKN9104CT-ND; Vendor 1: Digikey; Part Name: Switch,Tactile,SPST-NO,SMD,H1.5; CreatedBy: Judd Foster; HelpURL: https://www.ckswitches.com/media/1467/pts525.pdf; Manufacturer 1 Part Number: PTS525SM15SMTR2 LFS
U7 = STM32G474VET6: ARM Cortex-M Series 170MHz 86 LQFP-100(14x14) Microcontrollers ROHS; Manufacturer 1: ST Microelectronics; Vendor 1 Part Number: C431632; Vendor 1: LCSC; Part Name: STM32G474VET6; CreatedBy: Judd Foster; HelpURL: https://www.st.com/en/microcontrollers-microprocessors/stm32g474ve.html; Manufacturer 1 Part Number: STM32G474VET6
Y1 = XTAL,24MHz,8pF,SMD: SMD2016-4P Crystals ROHS; Manufacturer 1: NDK; Manufacturer 1 Part Number: NX2016SA-24MHZ-STD-CZS-2; Vendor 1 Part Number: C843257; Vendor 1: LCSC; Part Name: XTAL,24MHz,8pF,SMD; CreatedBy: Judd Foster; HelpURL: https://www.lcsc.com/datasheet/C843257.pdf
Y2 = XTAL,32.768kHz,12.5pF,SMD: Crystal Oscillator 12.5pF SMD3215-2P Crystals ROHS; Manufacturer 1: EPSON; Manufacturer 1 Part Number: Q13FC13500004; Vendor 1 Part Number: C32346; Vendor 1: LCSC; Part Name: XTAL,32.768kHz,12.5pF,SMD; CreatedBy: Judd Foster; HelpURL: https://www.lcsc.com/datasheet/C32346.pdf